# EAGLE schematic Hive 2.0 (EAGLE 9.6.2)
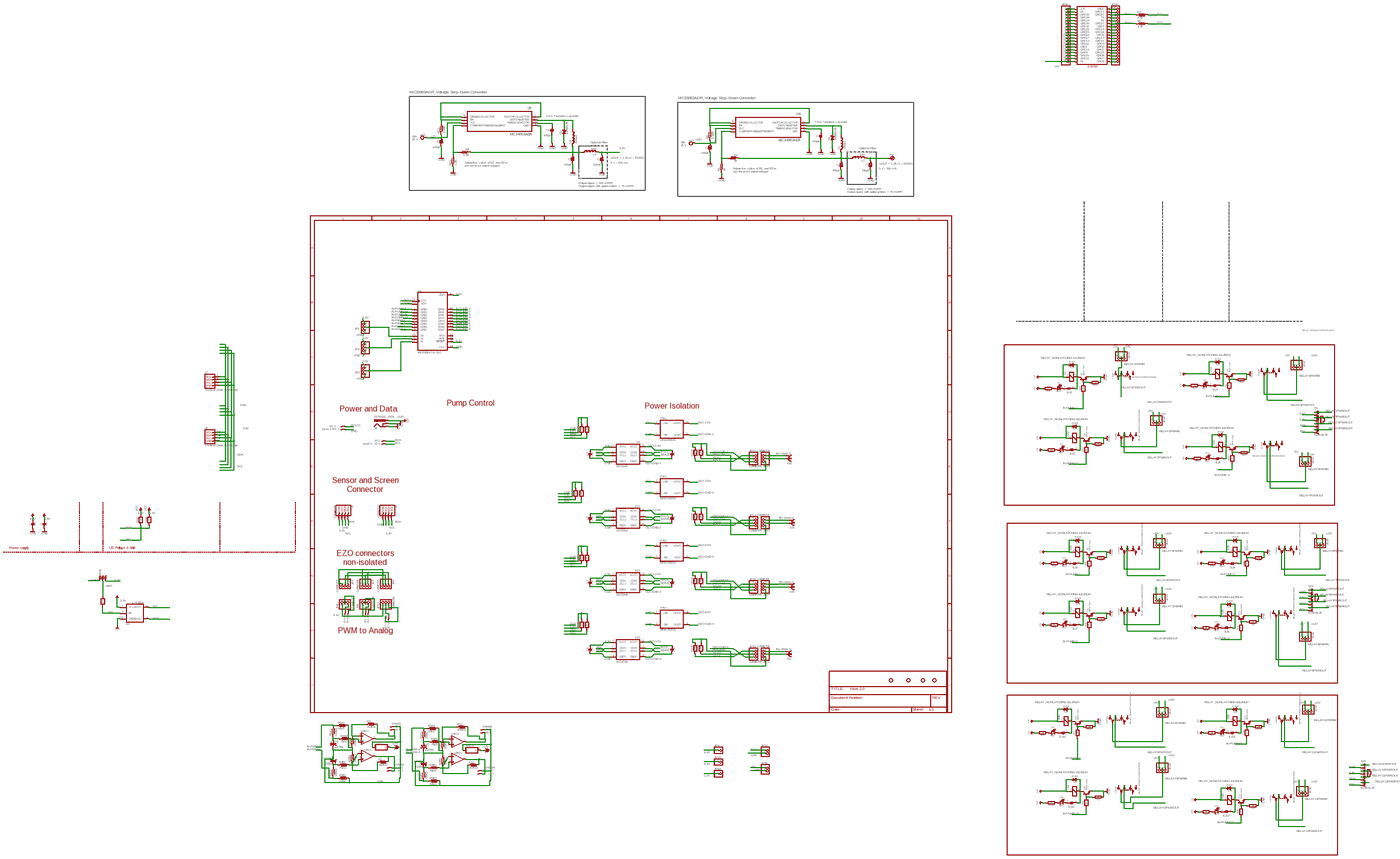
[diagram p0: schematic, sheet 1, overview]
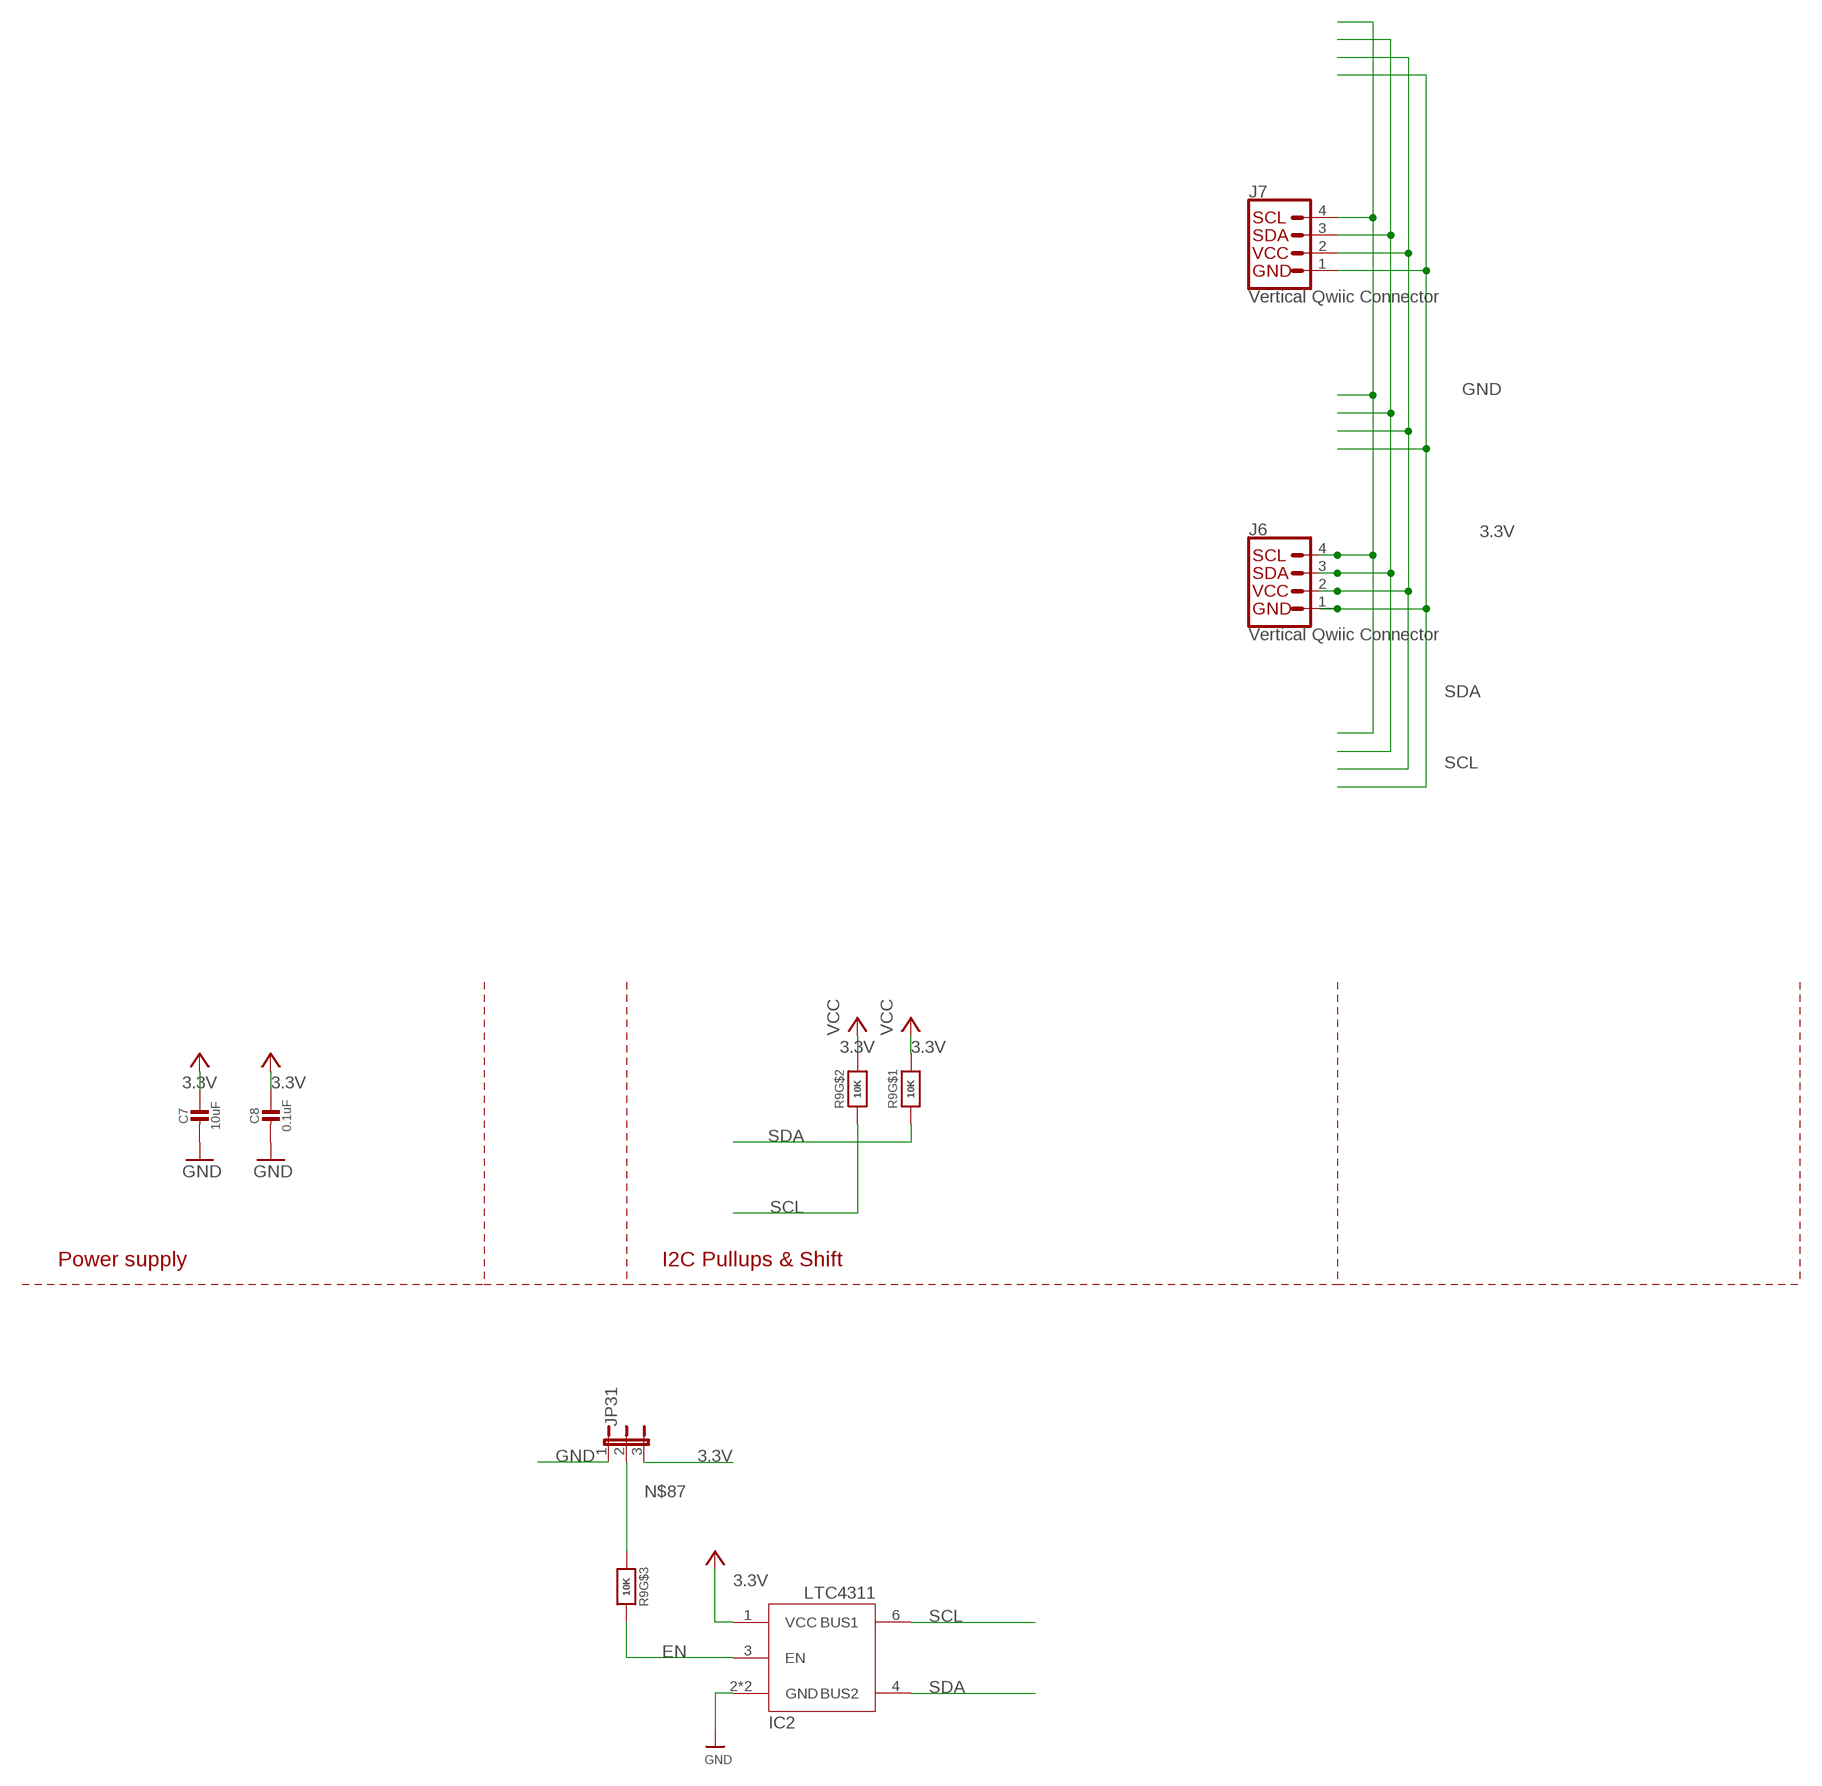
[diagram p1: schematic, sheet 1, part 1 of 6]
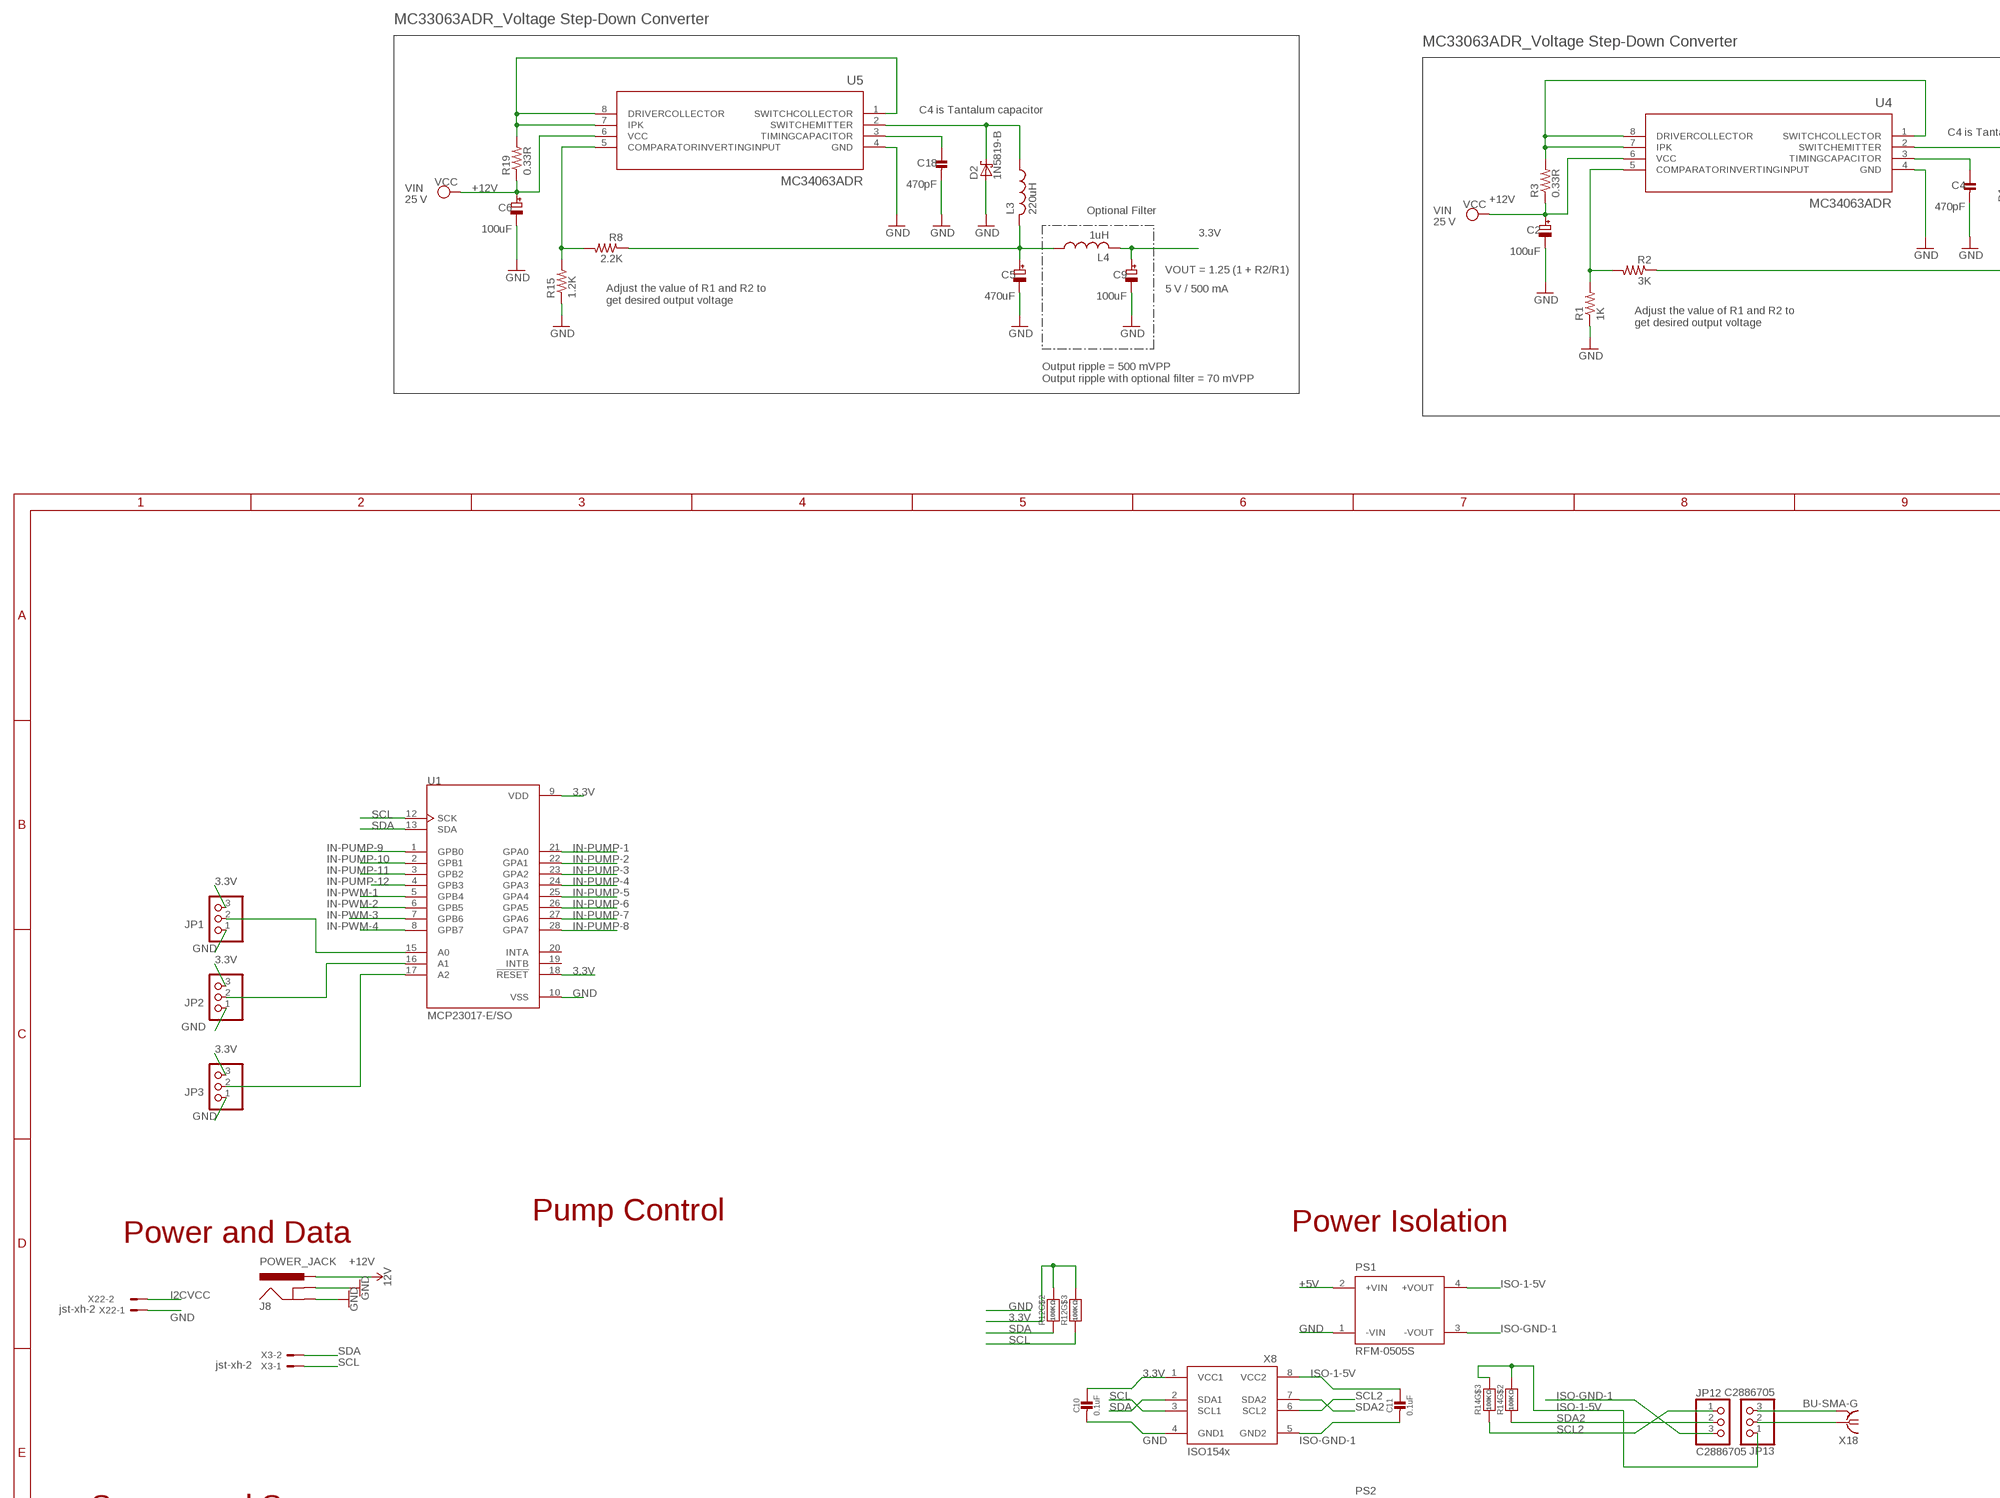
[diagram p2: schematic, sheet 1, part 2 of 6]
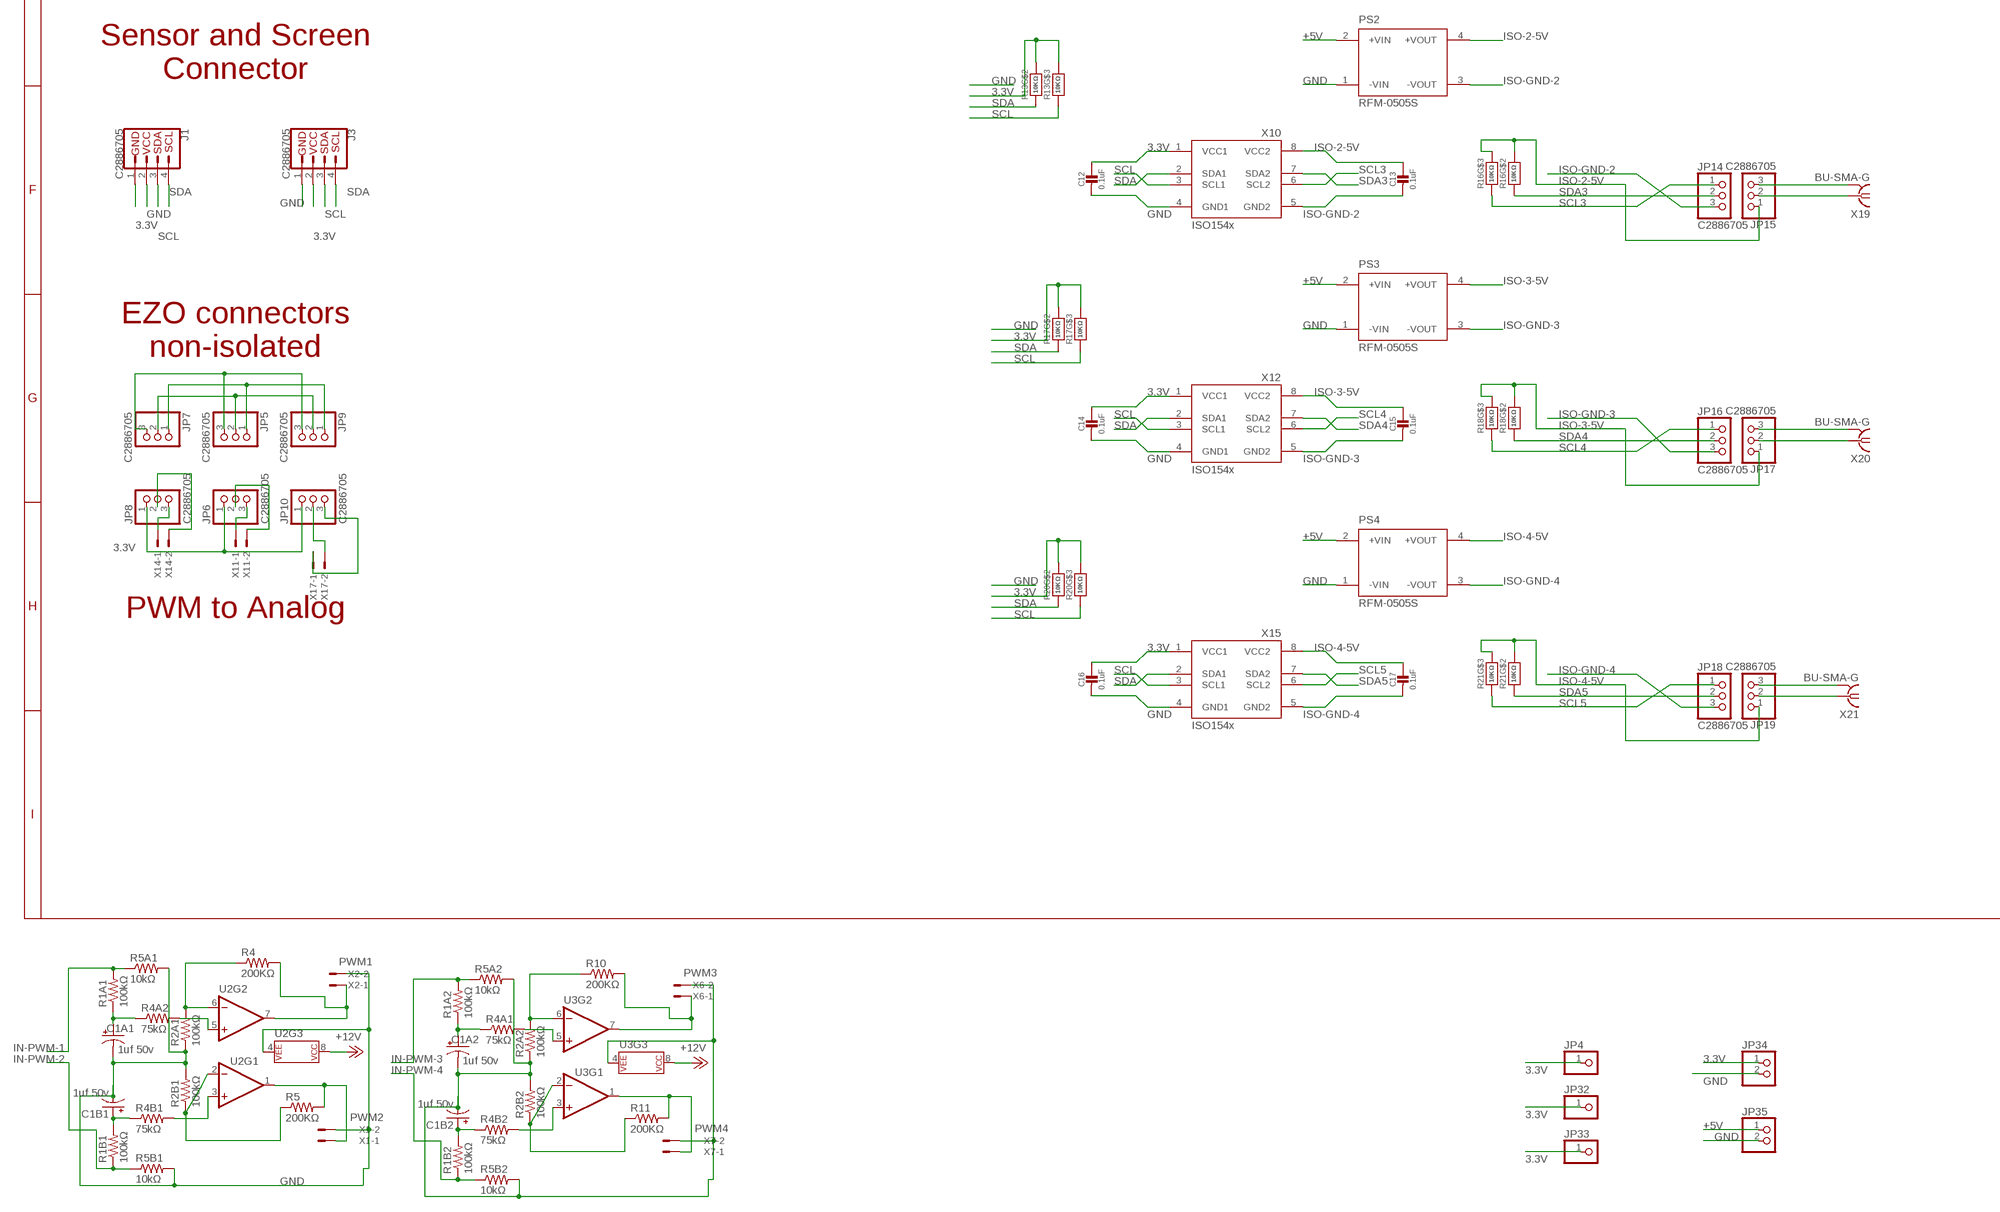
[diagram p3: schematic, sheet 1, part 3 of 6]
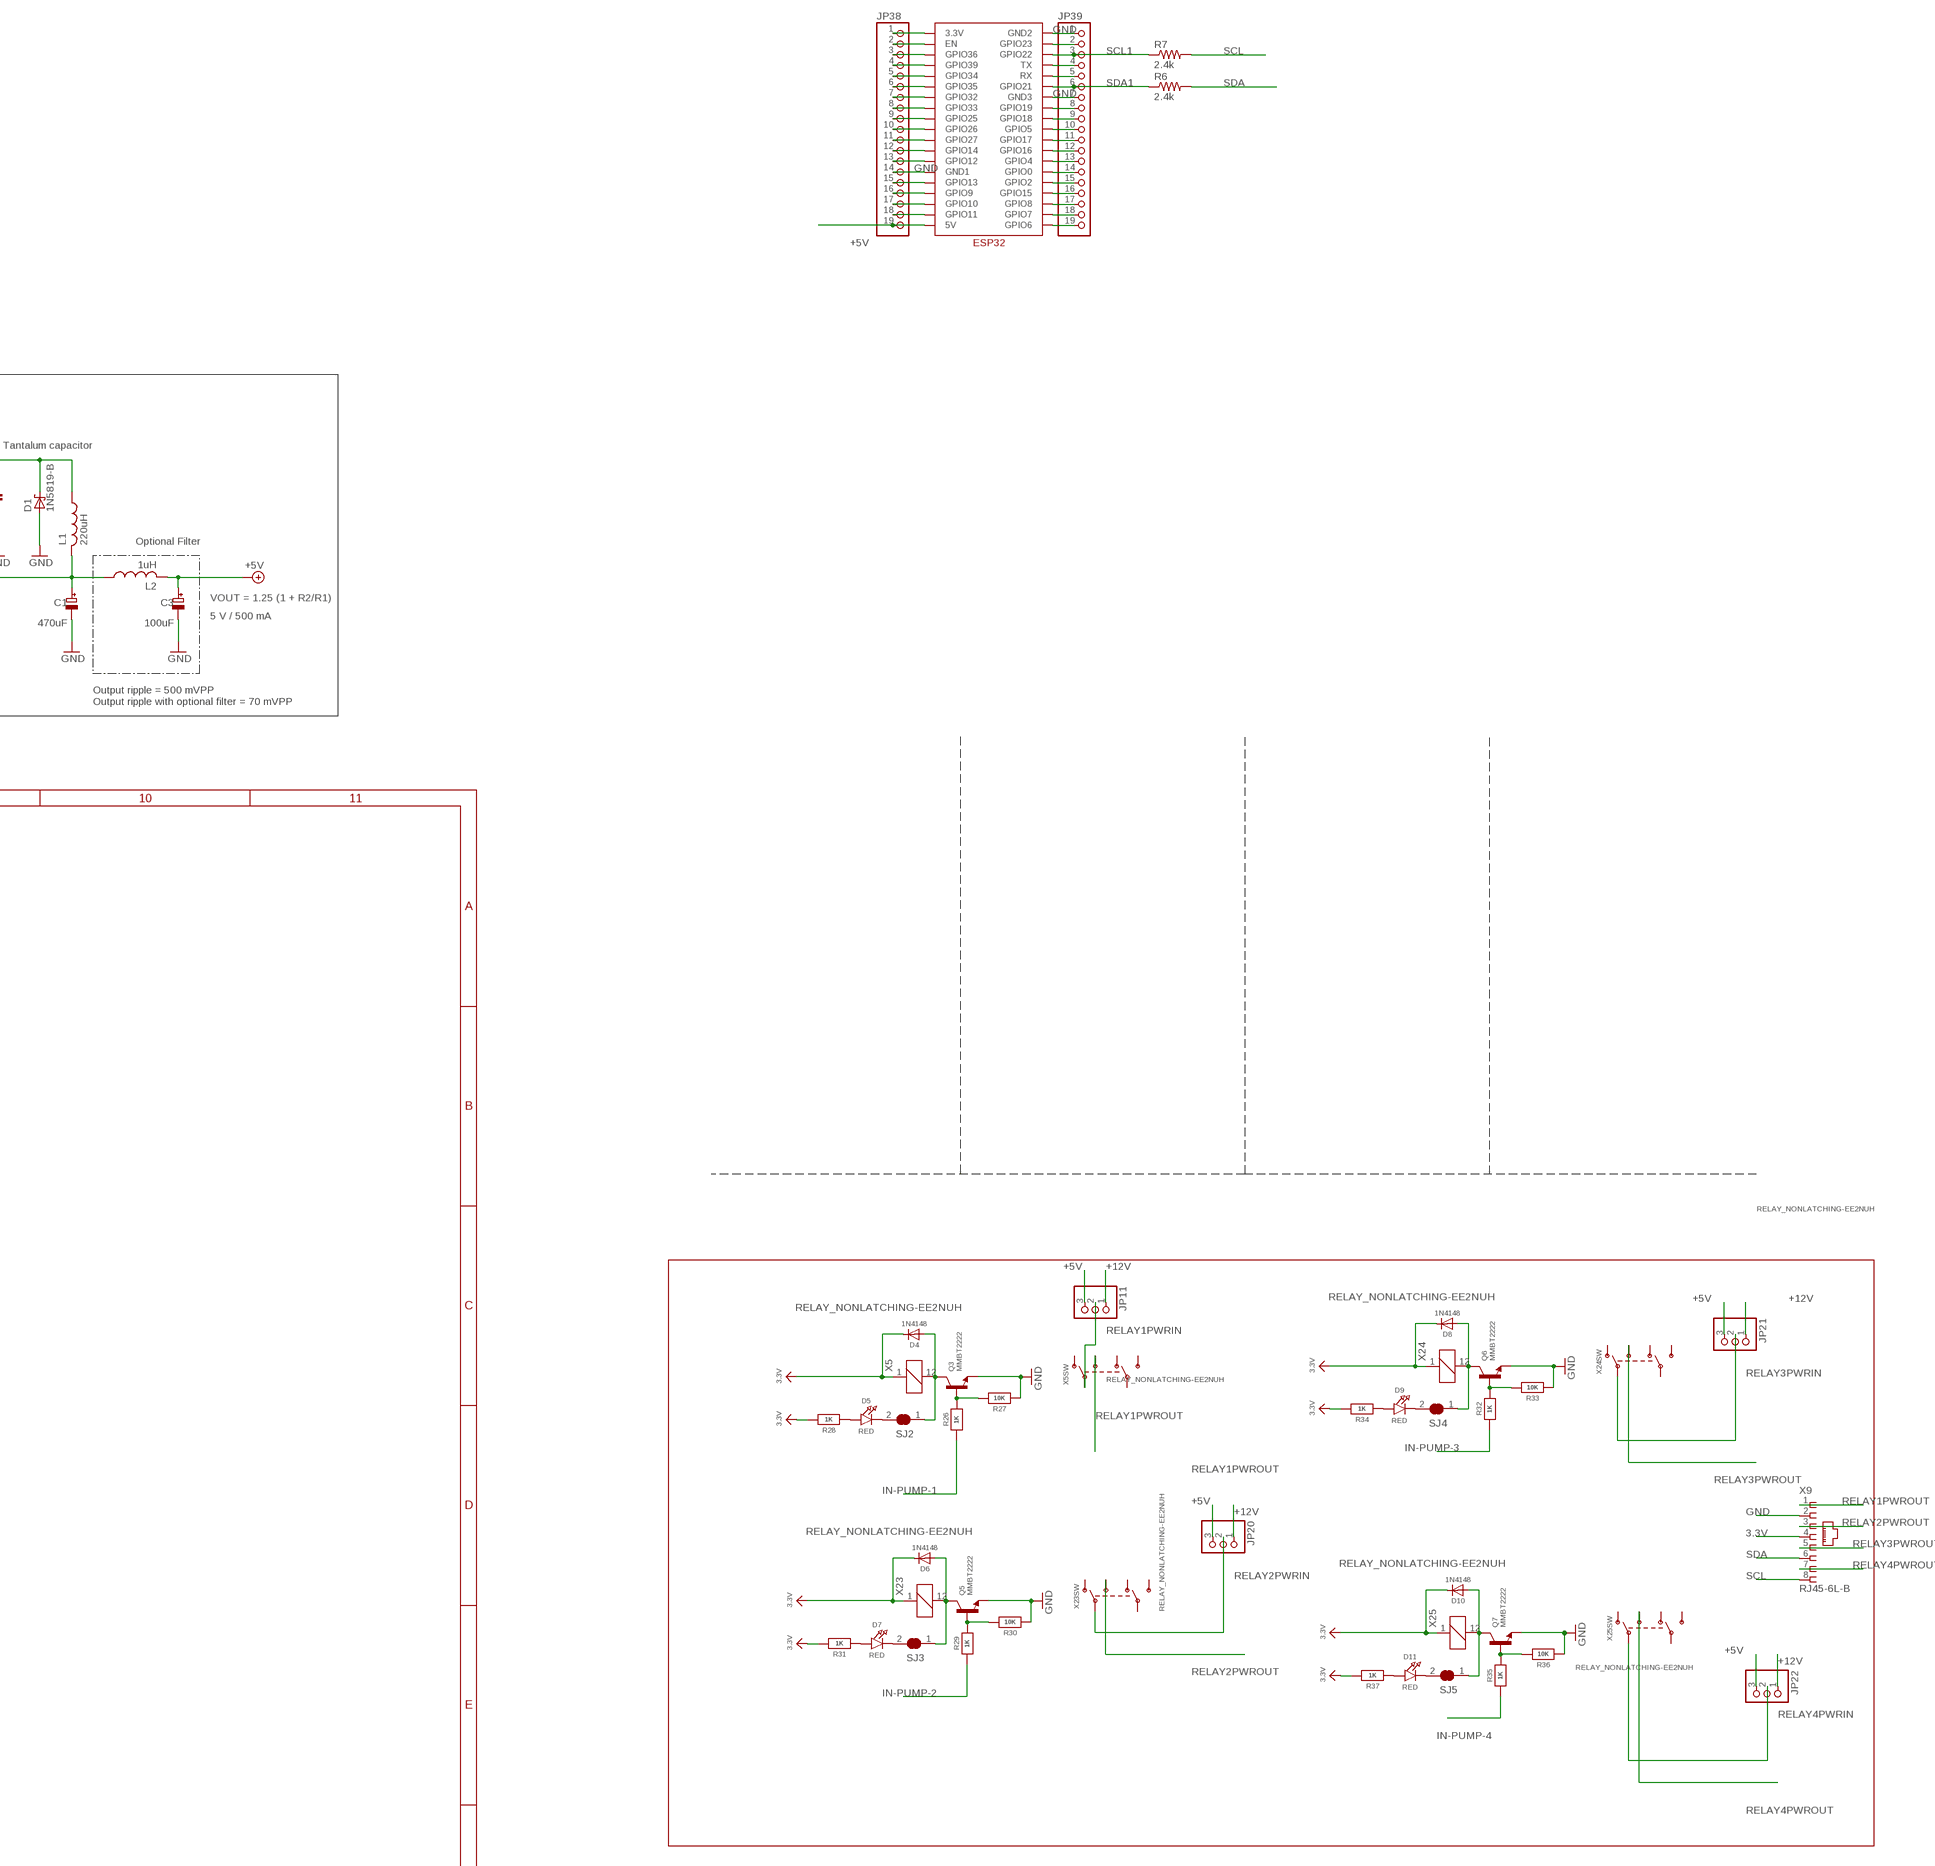
[diagram p4: schematic, sheet 1, part 4 of 6]
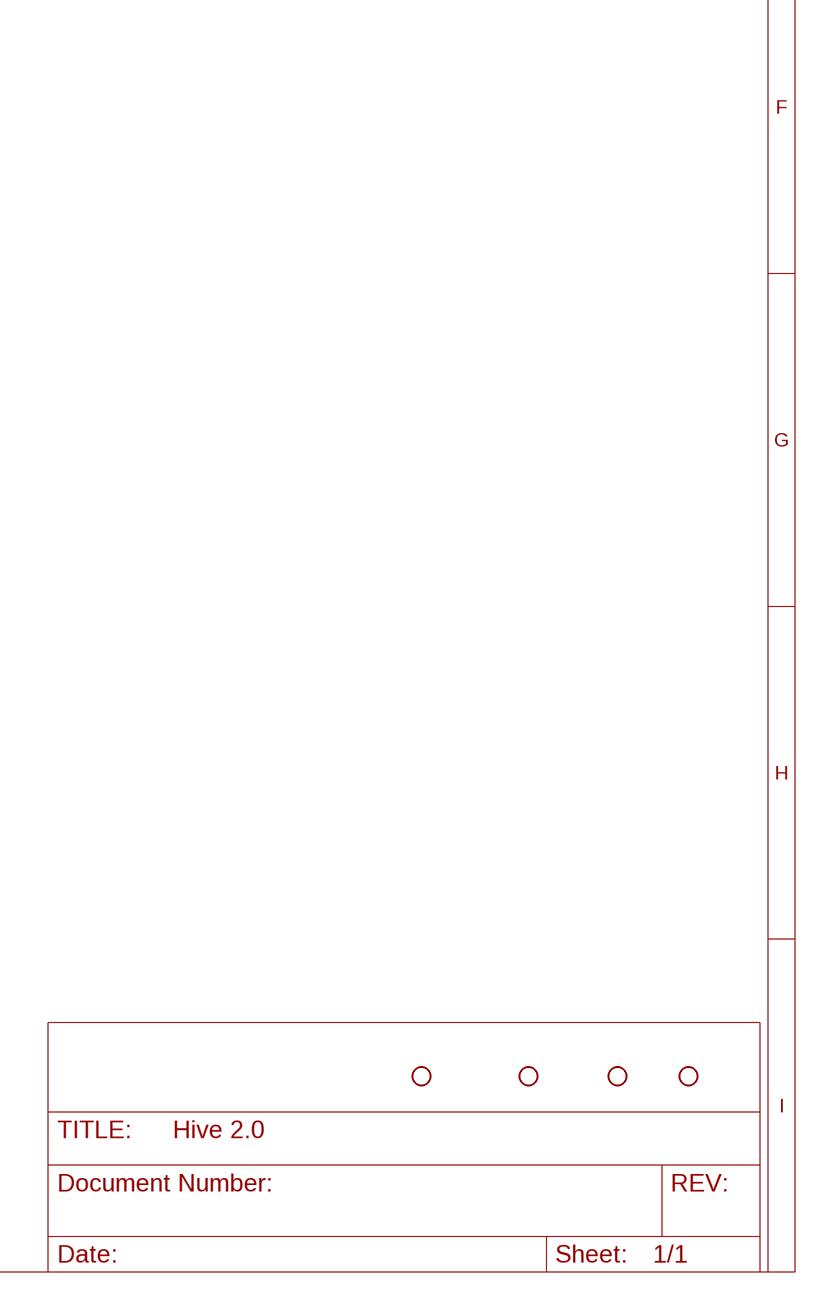
[diagram p5: schematic, sheet 1, part 5 of 6]
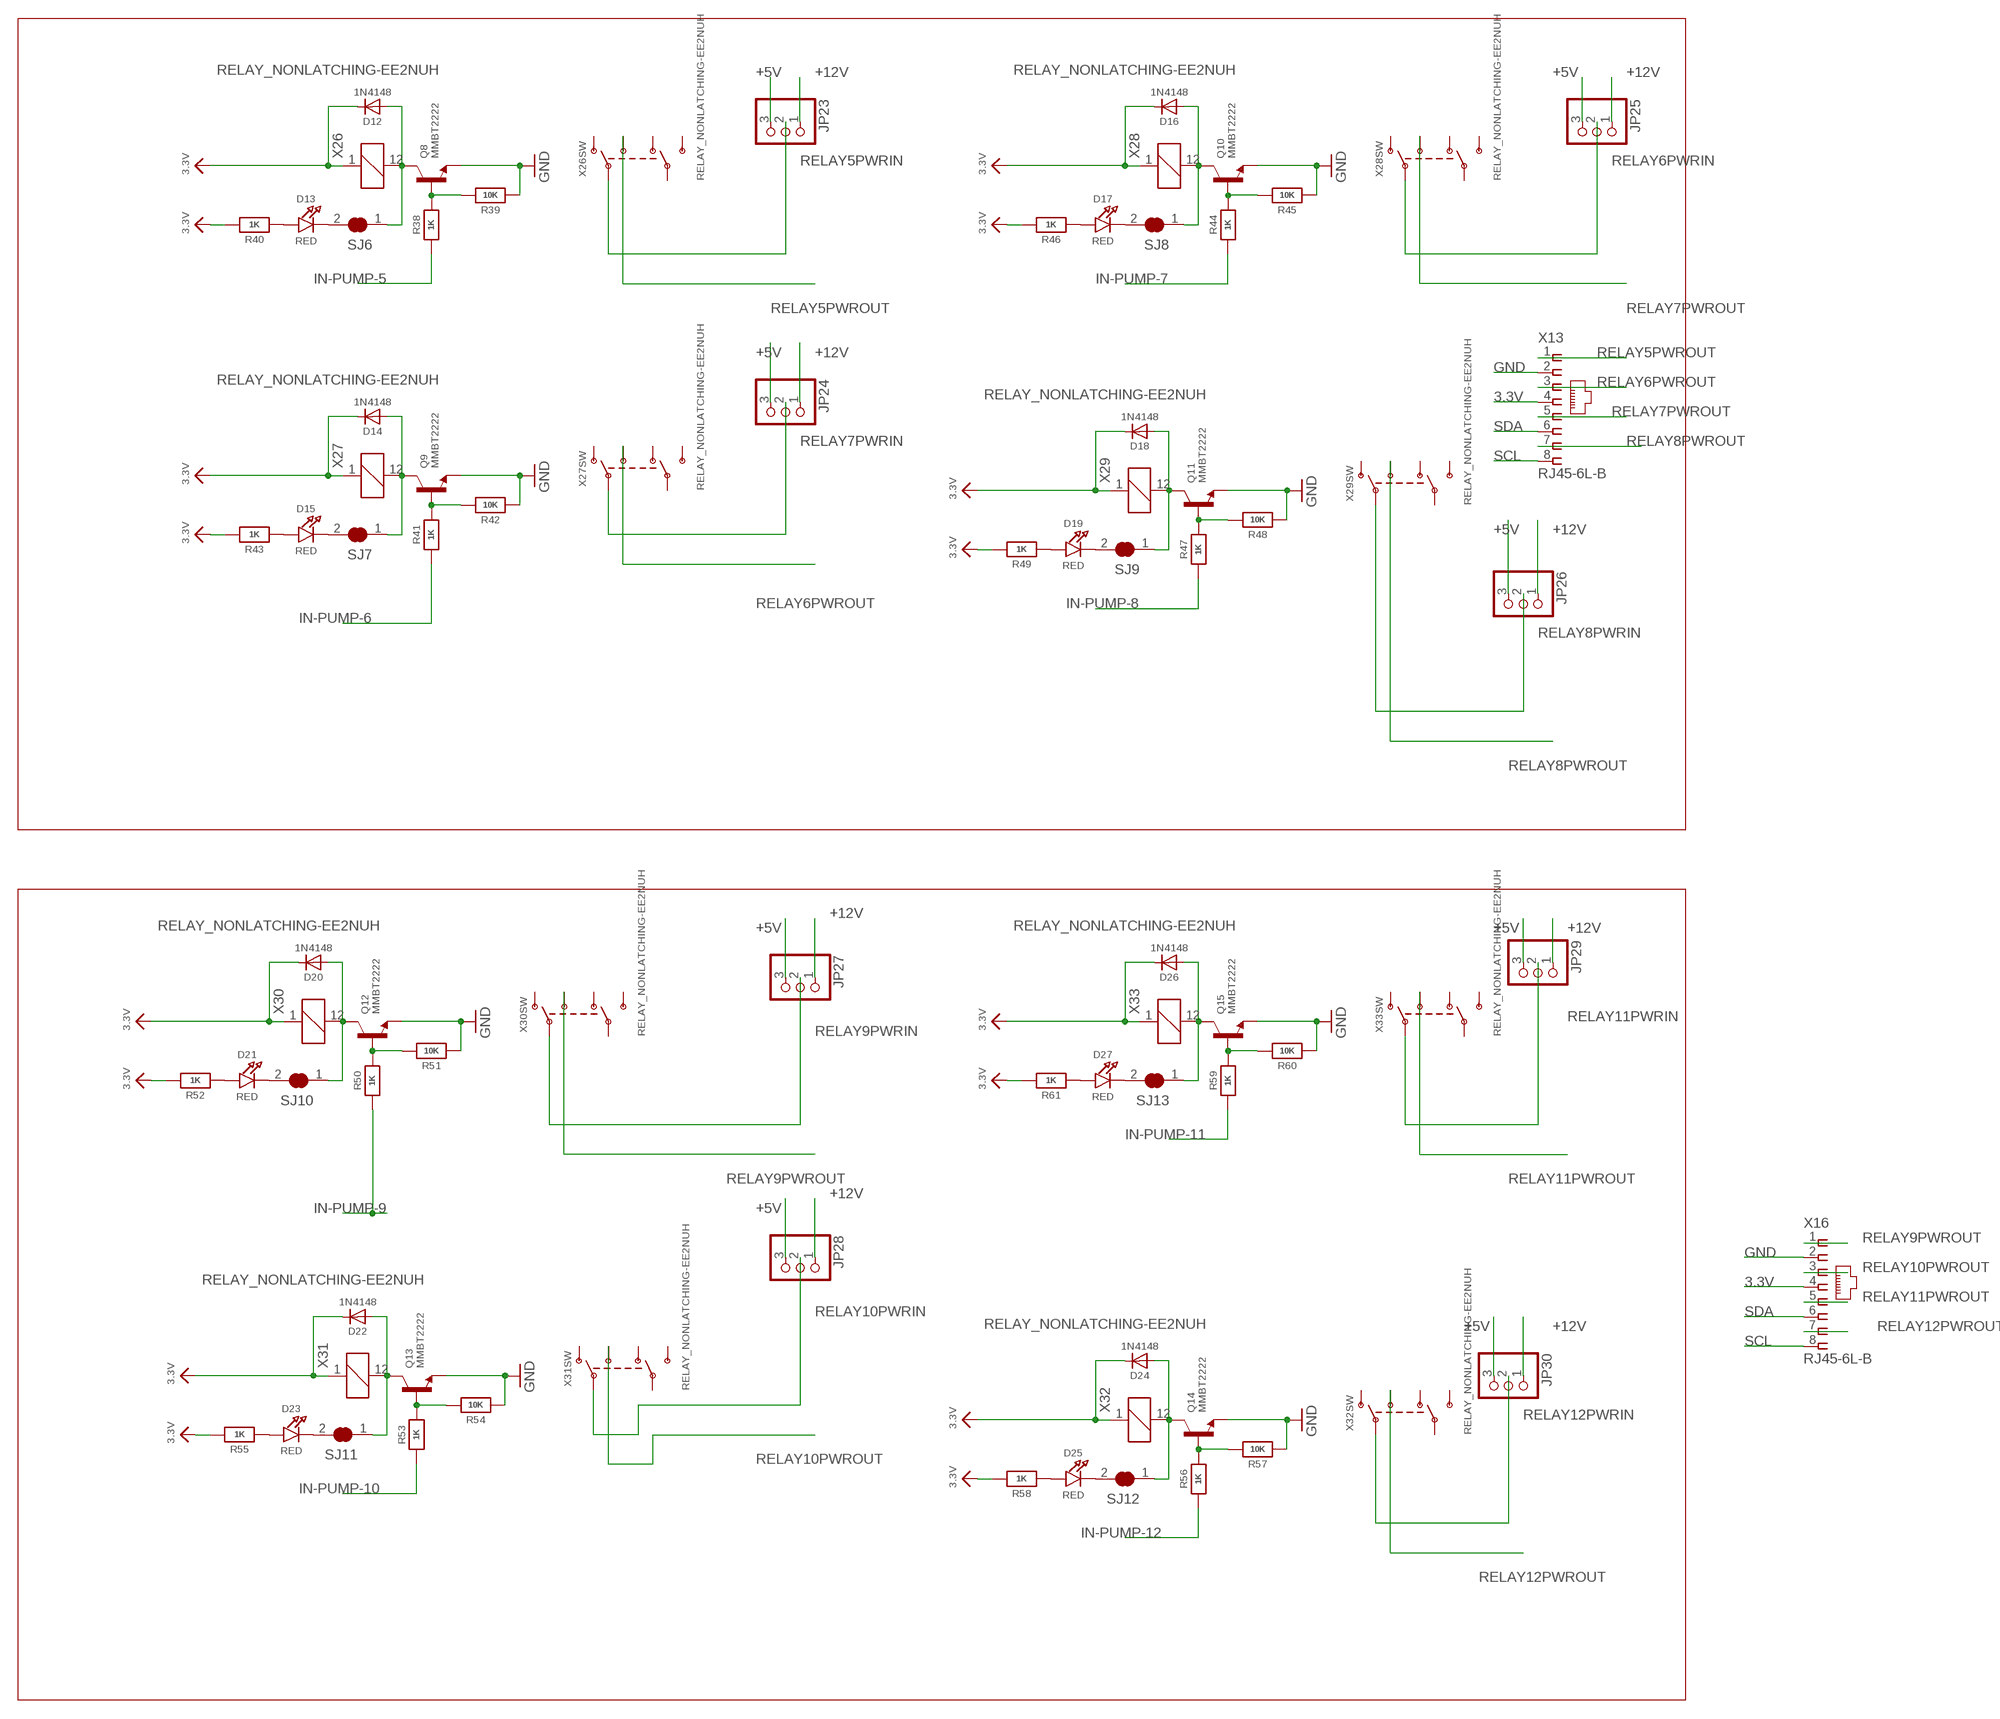
[diagram p6: schematic, sheet 1, part 6 of 6]

## Parts
C1  470uF  CAP_ELECTROLYTICPANASONIC_C  [PANASONIC_C]
C1A1  1uf 50v  CPOL-USUD-4X5,8  [UD-4X5,8_NICHICON]
C1A2  1uf 50v  CPOL-USUD-4X5,8  [UD-4X5,8_NICHICON]
C1B1  1uf 50v  CPOL-USUD-4X5,8  [UD-4X5,8_NICHICON]
C1B2  1uf 50v  CPOL-USUD-4X5,8  [UD-4X5,8_NICHICON]
C2  100uF  CAP_ELECTROLYTICPANASONIC_C  [PANASONIC_C]
C3  100uF  CAP_ELECTROLYTICPANASONIC_C  [PANASONIC_C]
C4  470pF  CAP_CERAMIC0805  [0805]
C5  470uF  CAP_ELECTROLYTICPANASONIC_C  [PANASONIC_C]
C6  100uF  CAP_ELECTROLYTICPANASONIC_C  [PANASONIC_C]
C7  10uF  CAP_CERAMIC0402  [0402]
C8  0.1uF  CAP_CERAMIC0805  [0805]
C9  100uF  CAP_ELECTROLYTICPANASONIC_C  [PANASONIC_C]
C10  0.1uF  CAP_CERAMIC0805  [0805]
C11  0.1uF  CAP_CERAMIC0805  [0805]
C12  0.1uF  CAP_CERAMIC0805  [0805]
C13  0.1uF  CAP_CERAMIC0805  [0805]
C14  0.1uF  CAP_CERAMIC0805  [0805]
C15  0.1uF  CAP_CERAMIC0805  [0805]
C16  0.1uF  CAP_CERAMIC0805  [0805]
C17  0.1uF  CAP_CERAMIC0805  [0805]
C18  470pF  CAP_CERAMIC0805  [0805]
D1  1N5819-B  [DO41-7.6]
D2  1N5819-B  [DO41-7.6]
D4  1N4148  DIODESOD-323  [SOD-323]
D5  RED  LED0805_NOOUTLINE  [CHIPLED_0805_NOOUTLINE]
D6  1N4148  DIODESOD-323  [SOD-323]
D7  RED  LED0805_NOOUTLINE  [CHIPLED_0805_NOOUTLINE]
D8  1N4148  DIODESOD-323  [SOD-323]
D9  RED  LED0805_NOOUTLINE  [CHIPLED_0805_NOOUTLINE]
D10  1N4148  DIODESOD-323  [SOD-323]
D11  RED  LED0805_NOOUTLINE  [CHIPLED_0805_NOOUTLINE]
D12  1N4148  DIODESOD-323  [SOD-323]
D13  RED  LED0805_NOOUTLINE  [CHIPLED_0805_NOOUTLINE]
D14  1N4148  DIODESOD-323  [SOD-323]
D15  RED  LED0805_NOOUTLINE  [CHIPLED_0805_NOOUTLINE]
D16  1N4148  DIODESOD-323  [SOD-323]
D17  RED  LED0805_NOOUTLINE  [CHIPLED_0805_NOOUTLINE]
D18  1N4148  DIODESOD-323  [SOD-323]
D19  RED  LED0805_NOOUTLINE  [CHIPLED_0805_NOOUTLINE]
D20  1N4148  DIODESOD-323  [SOD-323]
D21  RED  LED0805_NOOUTLINE  [CHIPLED_0805_NOOUTLINE]
D22  1N4148  DIODESOD-323  [SOD-323]
D23  RED  LED0805_NOOUTLINE  [CHIPLED_0805_NOOUTLINE]
D24  1N4148  DIODESOD-323  [SOD-323]
D25  RED  LED0805_NOOUTLINE  [CHIPLED_0805_NOOUTLINE]
D26  1N4148  DIODESOD-323  [SOD-323]
D27  RED  LED0805_NOOUTLINE  [CHIPLED_0805_NOOUTLINE]
H1  STAND-OFF  [STAND-OFF]
H2  STAND-OFF  [STAND-OFF]
H3  STAND-OFF  [STAND-OFF]
H4  STAND-OFF  [STAND-OFF]
IC2  LTC4311_SC70  [SC70-6L]
J1  C2886705  I2C_STANDARD  [1X04]
J3  C2886705  I2C_STANDARD  [1X04]
J6  Vertical Qwiic Connector  QWIIC_CONNECTOR  [JST04_1MM_VERT]
J7  Vertical Qwiic Connector  QWIIC_CONNECTOR  [JST04_1MM_VERT]
J8  POWER_JACK  [POWER_JACK_PTH]
JP1  HEADER-1X3ROUND  [1X03_ROUND]
JP2  HEADER-1X3ROUND  [1X03_ROUND]
JP3  HEADER-1X3ROUND  [1X03_ROUND]
JP4  HEADER-1X12MM  [1X01_2MM]
JP5  C2886705  PINHD-1X3CB  [1X03-CLEANBIG]
JP6  C2886705  PINHD-1X3CB  [1X03-CLEANBIG]
JP7  C2886705  PINHD-1X3CB  [1X03-CLEANBIG]
JP8  C2886705  PINHD-1X3CB  [1X03-CLEANBIG]
JP9  C2886705  PINHD-1X3CB  [1X03-CLEANBIG]
JP10  C2886705  PINHD-1X3CB  [1X03-CLEANBIG]
JP11  PINHD-1X3  [1X03]
JP12  C2886705  PINHD-1X3CB  [1X03-CLEANBIG]
JP13  C2886705  PINHD-1X3CB  [1X03-CLEANBIG]
JP14  C2886705  PINHD-1X3CB  [1X03-CLEANBIG]
JP15  C2886705  PINHD-1X3CB  [1X03-CLEANBIG]
JP16  C2886705  PINHD-1X3CB  [1X03-CLEANBIG]
JP17  C2886705  PINHD-1X3CB  [1X03-CLEANBIG]
JP18  C2886705  PINHD-1X3CB  [1X03-CLEANBIG]
JP19  C2886705  PINHD-1X3CB  [1X03-CLEANBIG]
JP20  PINHD-1X3  [1X03]
JP21  PINHD-1X3  [1X03]
JP22  PINHD-1X3  [1X03]
JP23  PINHD-1X3  [1X03]
JP24  PINHD-1X3  [1X03]
JP25  PINHD-1X3  [1X03]
JP26  PINHD-1X3  [1X03]
JP27  PINHD-1X3  [1X03]
JP28  PINHD-1X3  [1X03]
JP29  PINHD-1X3  [1X03]
JP30  PINHD-1X3  [1X03]
JP31  JUMPER3  [JUMPER3]
JP32  HEADER-1X12MM  [1X01_2MM]
JP33  HEADER-1X12MM  [1X01_2MM]
JP34  HEADER-1X2ROUND  [1X02_ROUND]
JP35  HEADER-1X2ROUND  [1X02_ROUND]
JP38  PINHD-1X19  [1X19]
JP39  PINHD-1X19  [1X19]
L1  220uH  L-USL3216C  [L3216C]
L2  1uH  L-USL3216C  [L3216C]
L3  220uH  L-USL3216C  [L3216C]
L4  1uH  L-USL3216C  [L3216C]
PS1  RFM-0505S  [CONV_RFM-0505S]
PS2  RFM-0505S  [CONV_RFM-0505S]
PS3  RFM-0505S  [CONV_RFM-0505S]
PS4  RFM-0505S  [CONV_RFM-0505S]
Q3  MMBT2222  TRANSISTOR_NPN  [SOT23-R]
Q5  MMBT2222  TRANSISTOR_NPN  [SOT23-R]
Q6  MMBT2222  TRANSISTOR_NPN  [SOT23-R]
Q7  MMBT2222  TRANSISTOR_NPN  [SOT23-R]
Q8  MMBT2222  TRANSISTOR_NPN  [SOT23-R]
Q9  MMBT2222  TRANSISTOR_NPN  [SOT23-R]
Q10  MMBT2222  TRANSISTOR_NPN  [SOT23-R]
Q11  MMBT2222  TRANSISTOR_NPN  [SOT23-R]
Q12  MMBT2222  TRANSISTOR_NPN  [SOT23-R]
Q13  MMBT2222  TRANSISTOR_NPN  [SOT23-R]
Q14  MMBT2222  TRANSISTOR_NPN  [SOT23-R]
Q15  MMBT2222  TRANSISTOR_NPN  [SOT23-R]
R1  1K  R-US_M0805  [M0805]
R1A1  100kΩ  R-US_M1206  [M1206]
R1A2  100kΩ  R-US_M1206  [M1206]
R1B1  100kΩ  R-US_M1206  [M1206]
R1B2  100kΩ  R-US_M1206  [M1206]
R2  3K  R-US_M0805  [M0805]
R2A1  100kΩ  R-US_M1206  [M1206]
R2A2  100kΩ  R-US_M1206  [M1206]
R2B1  100kΩ  R-US_M1206  [M1206]
R2B2  100kΩ  R-US_M1206  [M1206]
R3  0.33R  R-US_M0805  [M0805]
R4  200KΩ  R-US_R0402  [R0402]
R4A1  75kΩ  R-US_M1206  [M1206]
R4A2  75kΩ  R-US_M1206  [M1206]
R4B1  75kΩ  R-US_M1206  [M1206]
R4B2  75kΩ  R-US_M1206  [M1206]
R5  200KΩ  R-US_R0402  [R0402]
R5A1  10kΩ  R-US_M1206  [M1206]
R5A2  10kΩ  R-US_M1206  [M1206]
R5B1  10kΩ  R-US_M1206  [M1206]
R5B2  10kΩ  R-US_M1206  [M1206]
R6  2.4k  R-US_0309/12  [0309/12]
R7  2.4k  R-US_0309/12  [0309/12]
R8  2.2K  R-US_M0805  [M0805]
R9  10K  RESISTOR_4PACK  [RESPACK_4X0603]
R10  200KΩ  R-US_R0402  [R0402]
R11  200KΩ  R-US_R0402  [R0402]
R12  100KΩ  RESISTOR_4PACK  [RESPACK_4X0603]
R13  10KΩ  RESISTOR_4PACK  [RESPACK_4X0603]
R14  100KΩ  RESISTOR_4PACK  [RESPACK_4X0603]
R15  1.2K  R-US_M0805  [M0805]
R16  10KΩ  RESISTOR_4PACK  [RESPACK_4X0603]
R17  10KΩ  RESISTOR_4PACK  [RESPACK_4X0603]
R18  10KΩ  RESISTOR_4PACK  [RESPACK_4X0603]
R19  0.33R  R-US_M0805  [M0805]
R20  10KΩ  RESISTOR_4PACK  [RESPACK_4X0603]
R21  10KΩ  RESISTOR_4PACK  [RESPACK_4X0603]
R26  1K  RESISTOR0402  [0402]
R27  10K  RESISTOR0402  [0402]
R28  1K  RESISTOR0402  [0402]
R29  1K  RESISTOR0402  [0402]
R30  10K  RESISTOR0402  [0402]
R31  1K  RESISTOR0402  [0402]
R32  1K  RESISTOR0402  [0402]
R33  10K  RESISTOR0402  [0402]
R34  1K  RESISTOR0402  [0402]
R35  1K  RESISTOR0402  [0402]
R36  10K  RESISTOR0402  [0402]
R37  1K  RESISTOR0402  [0402]
R38  1K  RESISTOR0402  [0402]
R39  10K  RESISTOR0402  [0402]
R40  1K  RESISTOR0402  [0402]
R41  1K  RESISTOR0402  [0402]
R42  10K  RESISTOR0402  [0402]
R43  1K  RESISTOR0402  [0402]
R44  1K  RESISTOR0402  [0402]
R45  10K  RESISTOR0402  [0402]
R46  1K  RESISTOR0402  [0402]
R47  1K  RESISTOR0402  [0402]
R48  10K  RESISTOR0402  [0402]
R49  1K  RESISTOR0402  [0402]
R50  1K  RESISTOR0402  [0402]
R51  10K  RESISTOR0402  [0402]
R52  1K  RESISTOR0402  [0402]
R53  1K  RESISTOR0402  [0402]
R54  10K  RESISTOR0402  [0402]
R55  1K  RESISTOR0402  [0402]
R56  1K  RESISTOR0402  [0402]
R57  10K  RESISTOR0402  [0402]
R58  1K  RESISTOR0402  [0402]
R59  1K  RESISTOR0402  [0402]
R60  10K  RESISTOR0402  [0402]
R61  1K  RESISTOR0402  [0402]
SJ2  SOLDERJUMPER_CLOSED  [SOLDERJUMPER_CLOSEDWIRE]
SJ3  SOLDERJUMPER_CLOSED  [SOLDERJUMPER_CLOSEDWIRE]
SJ4  SOLDERJUMPER_CLOSED  [SOLDERJUMPER_CLOSEDWIRE]
SJ5  SOLDERJUMPER_CLOSED  [SOLDERJUMPER_CLOSEDWIRE]
SJ6  SOLDERJUMPER_CLOSED  [SOLDERJUMPER_CLOSEDWIRE]
SJ7  SOLDERJUMPER_CLOSED  [SOLDERJUMPER_CLOSEDWIRE]
SJ8  SOLDERJUMPER_CLOSED  [SOLDERJUMPER_CLOSEDWIRE]
SJ9  SOLDERJUMPER_CLOSED  [SOLDERJUMPER_CLOSEDWIRE]
SJ10  SOLDERJUMPER_CLOSED  [SOLDERJUMPER_CLOSEDWIRE]
SJ11  SOLDERJUMPER_CLOSED  [SOLDERJUMPER_CLOSEDWIRE]
SJ12  SOLDERJUMPER_CLOSED  [SOLDERJUMPER_CLOSEDWIRE]
SJ13  SOLDERJUMPER_CLOSED  [SOLDERJUMPER_CLOSEDWIRE]
U1  MCP23017-E/SO  [SOIC127P1030X265-28N]
U2  LM358  LM358SO08  [SO08]
U3  LM358  LM358SO08  [SO08]
U4  MC34063ADR  [D8]
U5  MC34063ADR  [D8]
U$2  ESP32  [ESP32]
X1  PWM2  JST-XH-02-PIN-LONG-PAD  [JST-XH-02-PACKAGE-LONG-PAD]
X2  PWM1  JST-XH-02-PIN-LONG-PAD  [JST-XH-02-PACKAGE-LONG-PAD]
X3  jst-xh-2  JST-XH-02-PIN-LONG-PAD  [JST-XH-02-PACKAGE-LONG-PAD]
X5  RELAY_NONLATCHING-EE2NUH  [RELAY_EE2_NOLATCH]
X6  PWM3  JST-XH-02-PIN-LONG-PAD  [JST-XH-02-PACKAGE-LONG-PAD]
X7  PWM4  JST-XH-02-PIN-LONG-PAD  [JST-XH-02-PACKAGE-LONG-PAD]
X8  ISO154X  [SOIC8_150MIL]
X9  RJ45-6L-B  [RJ45-NO-SHIELD]
X10  ISO154X  [SOIC8_150MIL]
X11  jst-xh-2  JST-XH-02-PIN-LONG-PAD  [JST-XH-02-PACKAGE-LONG-PAD]
X12  ISO154X  [SOIC8_150MIL]
X13  RJ45-6L-B  [RJ45-NO-SHIELD]
X14  jst-xh-2  JST-XH-02-PIN-LONG-PAD  [JST-XH-02-PACKAGE-LONG-PAD]
X15  ISO154X  [SOIC8_150MIL]
X16  RJ45-6L-B  [RJ45-NO-SHIELD]
X17  jst-xh-2  JST-XH-02-PIN-LONG-PAD  [JST-XH-02-PACKAGE-LONG-PAD]
X18  BU-SMA-G  [BU-SMA-G]
X19  BU-SMA-G  [BU-SMA-G]
X20  BU-SMA-G  [BU-SMA-G]
X21  BU-SMA-G  [BU-SMA-G]
X22  jst-xh-2  JST-XH-02-PIN-LONG-PAD  [JST-XH-02-PACKAGE-LONG-PAD]
X23  RELAY_NONLATCHING-EE2NUH  [RELAY_EE2_NOLATCH]
X24  RELAY_NONLATCHING-EE2NUH  [RELAY_EE2_NOLATCH]
X25  RELAY_NONLATCHING-EE2NUH  [RELAY_EE2_NOLATCH]
X26  RELAY_NONLATCHING-EE2NUH  [RELAY_EE2_NOLATCH]
X27  RELAY_NONLATCHING-EE2NUH  [RELAY_EE2_NOLATCH]
X28  RELAY_NONLATCHING-EE2NUH  [RELAY_EE2_NOLATCH]
X29  RELAY_NONLATCHING-EE2NUH  [RELAY_EE2_NOLATCH]
X30  RELAY_NONLATCHING-EE2NUH  [RELAY_EE2_NOLATCH]
X31  RELAY_NONLATCHING-EE2NUH  [RELAY_EE2_NOLATCH]
X32  RELAY_NONLATCHING-EE2NUH  [RELAY_EE2_NOLATCH]
X33  RELAY_NONLATCHING-EE2NUH  [RELAY_EE2_NOLATCH]

## Nets
3.3V: C7.1 C8.1 C9.+ C10.1 C12.1 C14.1 C16.1 D4.C D6.C D8.C D10.C D12.C D14.C D16.C D18.C D20.C D22.C D24.C D26.C IC2.1(VCC) J1.1 J3.2 J6.3 J7.3 JP1.3 JP2.3 JP3.3 JP4.1 JP6.1 JP8.1 JP10.1 JP31.3 JP32.1 JP33.1 JP34.1 L4.2 R9.7 R9.8 R12.6 R12.7 R13.6 R13.7 R17.6 R17.7 R20.6 R20.7 R28.2 R31.2 R34.2 R37.2 R40.2 R43.2 R46.2 R49.2 R52.2 R55.2 R58.2 R61.2 U1.9(VDD) U1.18(!RESET) X5.1 X8.1(VCC1) X9.4 X10.1(VCC1) X12.1(VCC1) X13.4 X15.1(VCC1) X16.4 X23.1 X24.1 X25.1 X26.1 X27.1 X28.1 X29.1 X30.1 X31.1 X32.1 X33.1 ; supply symbol labelled VCC
+5V [5v]: C3.+ JP11.3 JP20.3 JP21.3 JP22.3 JP23.3 JP24.3 JP25.3 JP26.3 JP27.3 JP28.3 JP29.3 JP30.3 JP35.1 JP38.19 L2.2 PS1.2(+VIN) PS2.2(+VIN) PS3.2(+VIN) PS4.2(+VIN) U$2.5V
+12V [12v]: C2.+ C6.+ J8.PWR JP11.1 JP20.1 JP21.1 JP22.1 JP23.1 JP24.1 JP25.1 JP26.1 JP27.1 JP28.1 JP29.1 JP30.1 R3.1 R19.1 U2.8(P$V+) U3.8(P$V+) U4.6(VCC) U5.6(VCC) ; supply symbol labelled 12V, VCC
EN: IC2.3(EN) R9.6
GND: C1.- C1A1.- C1A2.- C1B1.- C1B2.- C2.- C3.- C4.2 C5.- C6.- C7.2 C8.2 C9.- C10.2 C12.2 C14.2 C16.2 C18.2 D1.A D2.A IC2.2(GND) IC2.5(GND) J1.2 J3.1 J6.4 J7.4 J8.GND J8.GNDBREAK JP1.1 JP2.1 JP3.1 JP5.3 JP7.3 JP9.3 JP31.1 JP34.2 JP35.2 JP38.14 JP39.1 JP39.7 PS1.1(-VIN) PS2.1(-VIN) PS3.1(-VIN) PS4.1(-VIN) Q3.2(E) Q5.2(E) Q6.2(E) Q7.2(E) Q8.2(E) Q9.2(E) Q10.2(E) Q11.2(E) Q12.2(E) Q13.2(E) Q14.2(E) Q15.2(E) R1.1 R2A1.1 R2A2.1 R2B1.2 R2B2.2 R5A1.2 R5A2.2 R5B1.2 R5B2.2 R15.1 R27.1 R30.1 R33.1 R36.1 R39.1 R42.1 R45.1 R48.1 R51.1 R54.1 R57.1 R60.1 U1.10(VSS) U2.4(P$V-) U3.4(P$V-) U4.4(GND) U5.4(GND) U$2.GND1 U$2.GND2 U$2.GND3 X1.2 X2.2 X6.2 X7.2 X8.4(GND1) X9.2 X10.4(GND1) X12.4(GND1) X13.2 X15.4(GND1) X16.2 X22.1
I2CVCC: X22.2
IN-PUMP-1: R26.1 U1.21(GPA0)
IN-PUMP-2: R29.1 U1.22(GPA1)
IN-PUMP-3: R32.1 U1.23(GPA2)
IN-PUMP-4: R35.1 U1.24(GPA3)
IN-PUMP-5 [GPIO]: R38.1 U1.25(GPA4)
IN-PUMP-6 [GPIO]: R41.1 U1.26(GPA5)
IN-PUMP-7 [GPIO]: R44.1 U1.27(GPA6)
IN-PUMP-8 [GPIO]: R47.1 U1.28(GPA7)
IN-PUMP-9 [GPIO]: R50.1 U1.1(GPB0)
IN-PUMP-10 [GPIO]: R53.1 U1.2(GPB1)
IN-PUMP-11 [GPIO]: R59.1 U1.3(GPB2)
IN-PUMP-12 [GPIO]: R56.1 U1.4(GPB3)
IN-PWM-1: R1A1.2 R5A1.1 U1.5(GPB4)
IN-PWM-2: R1B1.1 R5B1.1 U1.6(GPB5)
IN-PWM-3: R1A2.2 R5A2.1 U1.7(GPB6)
IN-PWM-4: R1B2.1 R5B2.1 U1.8(GPB7)
ISO-1-5V: C11.1 JP13.1 PS1.4(+VOUT) R14.6 R14.7 X8.8(VCC2)
ISO-2-5V: C13.1 JP15.1 PS2.4(+VOUT) R16.6 R16.7 X10.8(VCC2)
ISO-3-5V: C15.1 JP17.1 PS3.4(+VOUT) R18.6 R18.7 X12.8(VCC2)
ISO-4-5V: C17.1 JP19.1 PS4.4(+VOUT) R21.6 R21.7 X15.8(VCC2)
ISO-GND-1: C11.2 JP12.3 PS1.3(-VOUT) X8.5(GND2)
ISO-GND-2: C13.2 JP14.3 PS2.3(-VOUT) X10.5(GND2)
ISO-GND-3: C15.2 JP16.3 PS3.3(-VOUT) X12.5(GND2)
ISO-GND-4: C17.2 JP18.3 PS4.3(-VOUT) X15.5(GND2)
ISO-PRB-1+: JP13.2 X18.1
ISO-PRB-1GND: JP13.3 X18.2 X18.3 X18.4 X18.5
ISO-PRB-2+: JP15.2 X19.1
ISO-PRB-2GND: JP15.3 X19.2 X19.3 X19.4 X19.5
ISO-PRB-3+: JP17.2 X20.1
ISO-PRB-3GND: JP17.3 X20.2 X20.3 X20.4 X20.5
ISO-PRB-4+: JP19.2 X21.1
ISO-PRB-4GND: JP19.3 X21.2 X21.3 X21.4 X21.5
N$1: C1A1.+ R1A1.1 R4A2.1
N$2: D1.C L1.1 U4.2(SWITCHEMITTER)
N$3: C1.+ L1.2 L2.1 R2.1
N$4: C4.1 U4.3(TIMINGCAPACITOR)
N$5: C1B1.+ R1B1.2 R4B1.1
N$6: R2A1.2 R4.1 U2.6(-IN)
N$7: R1.2 R2.2 U4.5(COMPARATORINVERTINGINPUT)
N$8: R2B1.1 R5.1 U2.2(-IN)
N$9: R3.2 U4.1(SWITCHCOLLECTOR) U4.7(IPK) U4.8(DRIVERCOLLECTOR)
N$10: R4A2.2 U2.5(+IN)
N$11: R4B1.2 U2.3(+IN)
N$12: D2.C L3.1 U5.2(SWITCHEMITTER)
N$13: D4.A Q3.3(C) SJ2.1 X5.12
N$14: Q3.1(B) R26.2 R27.2
N$15: D6.A Q5.3(C) SJ3.1 X23.12
N$16: D5.A R28.1
N$17: D5.C SJ2.2
N$18: Q5.1(B) R29.2 R30.2
N$19: D8.A Q6.3(C) SJ4.1 X24.12
N$20: D7.A R31.1
N$21: D7.C SJ3.2
N$22: C18.1 U5.3(TIMINGCAPACITOR)
N$23: Q6.1(B) R32.2 R33.2
N$24: R8.2 R15.2 U5.5(COMPARATORINVERTINGINPUT)
N$25: R19.2 U5.1(SWITCHCOLLECTOR) U5.7(IPK) U5.8(DRIVERCOLLECTOR)
N$26: C5.+ L3.2 L4.1 R8.1
N$27: D10.A Q7.3(C) SJ5.1 X25.12
N$28: D9.A R34.1
N$29: D9.C SJ4.2
N$30: Q7.1(B) R35.2 R36.2
N$31: D12.A Q8.3(C) SJ6.1 X26.12
N$32: D11.A R37.1
N$33: D11.C SJ5.2
N$34: Q8.1(B) R38.2 R39.2
N$35: D14.A Q9.3(C) SJ7.1 X27.12
N$36: D13.A R40.1
N$37: D13.C SJ6.2
N$38: Q9.1(B) R41.2 R42.2
N$39: D16.A Q10.3(C) SJ8.1 X28.12
N$40: D15.A R43.1
N$41: D15.C SJ7.2
N$42: Q10.1(B) R44.2 R45.2
N$43: D18.A Q11.3(C) SJ9.1 X29.12
N$44: D17.A R46.1
N$45: D17.C SJ8.2
N$46: Q11.1(B) R47.2 R48.2
N$47: D20.A Q12.3(C) SJ10.1 X30.12
N$48: D19.A R49.1
N$49: D19.C SJ9.2
N$50: Q12.1(B) R50.2 R51.2
N$51: D22.A Q13.3(C) SJ11.1 X31.12
N$52: D21.A R52.1
N$53: C1A2.+ R1A2.1 R4A1.1
N$54: C1B2.+ R1B2.2 R4B2.1
N$55: R2A2.2 R10.1 U3.6(-IN)
N$56: R2B2.1 R11.1 U3.2(-IN)
N$57: R4A1.2 U3.5(+IN)
N$58: R4B2.2 U3.3(+IN)
N$59: D21.C SJ10.2
N$60: Q13.1(B) R53.2 R54.2
N$61: D24.A Q14.3(C) SJ12.1 X32.12
N$62: D23.A R55.1
N$63: D23.C SJ11.2
N$64: Q14.1(B) R56.2 R57.2
N$65: JP38.1 U$2.3.3V
N$66: D25.A R58.1
N$67: D25.C SJ12.2
N$68: JP38.2 U$2.EN
N$69: D26.A Q15.3(C) SJ13.1 X33.12
N$70: Q15.1(B) R59.2 R60.2
N$71: JP38.3 U$2.GPIO36
N$72: D27.A R61.1
N$73: D27.C SJ13.2
N$74: JP1.2 U1.15(A0)
N$75: JP2.2 U1.16(A1)
N$76: JP3.2 U1.17(A2)
N$77: JP38.4 U$2.GPIO39
N$78: JP38.5 U$2.GPIO34
N$79: JP38.6 U$2.GPIO35
N$80: JP38.7 U$2.GPIO32
N$81: JP38.8 U$2.GPIO33
N$82: JP38.9 U$2.GPIO25
N$83: JP38.10 U$2.GPIO26
N$84: JP38.11 U$2.GPIO27
N$85: JP38.12 U$2.GPIO14
N$86: JP38.13 U$2.GPIO12
N$87: JP31.2 R9.3
N$89: JP38.16 U$2.GPIO9
N$90: JP38.15 U$2.GPIO13
N$91: JP38.17 U$2.GPIO10
N$92: JP38.18 U$2.GPIO11
N$94: JP39.19 U$2.GPIO6
N$95: JP39.18 U$2.GPIO7
N$96: JP39.17 U$2.GPIO8
N$97: JP39.16 U$2.GPIO15
N$98: JP39.15 U$2.GPIO2
N$99: JP39.14 U$2.GPIO0
N$100: JP39.13 U$2.GPIO4
N$101: JP39.12 U$2.GPIO16
N$102: JP39.11 U$2.GPIO17
N$103: JP39.10 U$2.GPIO5
N$104: JP39.9 U$2.GPIO18
N$105: JP39.8 U$2.GPIO19
N$108: JP39.5 U$2.RX
N$109: JP39.4 U$2.TX
N$111: JP39.2 U$2.GPIO23
NISO-PRB-1+: JP6.2 X11.2
NISO-PRB-1GND: JP6.3 X11.1
NISO-PRB-2+: JP8.2 X14.2
NISO-PRB-2GND: JP8.3 X14.1
NISO-PRB-3+: JP10.2 X17.2
NISO-PRB-3GND: JP10.3 X17.1
PWM-OUT-1: R4.2 U2.7(OUT) X2.1
PWM-OUT-2: R5.2 U2.1(OUT) X1.1
PWM-OUT-3: R10.2 U3.7(OUT) X6.1
PWM-OUT-4: R11.2 U3.1(OUT) X7.1
RELAY1PWRIN [HV]: JP11.2 X5.9(SW:P1)
RELAY1PWROUT [HV]: X5.8(SW:S1) X9.1
RELAY2PWRIN [HV]: JP20.2 X23.9(SW:P1)
RELAY2PWROUT [HV]: X9.3 X23.8(SW:S1)
RELAY3PWRIN [HV]: JP21.2 X24.9(SW:P1)
RELAY3PWROUT [HV]: X9.5 X24.8(SW:S1)
RELAY4PWRIN [HV]: JP22.2 X25.9(SW:P1)
RELAY4PWROUT [HV]: X9.7 X25.8(SW:S1)
RELAY5PWRIN [HV]: JP23.2 X26.9(SW:P1)
RELAY5PWROUT [HV]: X13.1 X26.8(SW:S1)
RELAY6PWRIN [HV]: JP25.2 X28.9(SW:P1)
RELAY6PWROUT [HV]: X13.3 X27.8(SW:S1)
RELAY7PWRIN [HV]: JP24.2 X27.9(SW:P1)
RELAY7PWROUT [HV]: X13.5 X28.8(SW:S1)
RELAY8PWRIN [HV]: JP26.2 X29.9(SW:P1)
RELAY8PWROUT [HV]: X13.7 X29.8(SW:S1)
RELAY9PWRIN [HV]: JP27.2 X30.9(SW:P1)
RELAY9PWROUT [HV]: X16.1 X30.8(SW:S1)
RELAY10PWRIN [HV]: JP28.2 X31.9(SW:P1)
RELAY10PWROUT [HV]: X16.3 X31.8(SW:S1)
RELAY11PWRIN [HV]: JP29.2 X33.9(SW:P1)
RELAY11PWROUT [HV]: X16.5 X33.8(SW:S1)
RELAY12PWRIN [HV]: JP30.2 X32.9(SW:P1)
RELAY12PWROUT [HV]: X16.7 X32.8(SW:S1)
SCL [i2c]: IC2.6(BUS1) J1.3 J3.3 J6.1 J7.1 JP5.1 JP7.1 JP9.1 R7.2 R9.2 R12.3 R13.3 R17.3 R20.3 U1.12(SCK) X3.1 X8.3(SCL1) X9.8 X10.3(SCL1) X12.3(SCL1) X13.8 X15.3(SCL1) X16.8
SCL1: JP39.3 R7.1 U$2.GPIO22
SCL2: JP12.1 R14.3 X8.6(SCL2)
SCL3: JP14.1 R16.3 X10.6(SCL2)
SCL4: JP16.1 R18.3 X12.6(SCL2)
SCL5: JP18.1 R21.3 X15.6(SCL2)
SDA [i2c]: IC2.4(BUS2) J1.4 J3.4 J6.2 J7.2 JP5.2 JP7.2 JP9.2 R6.2 R9.1 R12.2 R13.2 R17.2 R20.2 U1.13(SDA) X3.2 X8.2(SDA1) X9.6 X10.2(SDA1) X12.2(SDA1) X13.6 X15.2(SDA1) X16.6
SDA1: JP39.6 R6.1 U$2.GPIO21
SDA2: JP12.2 R14.2 X8.7(SDA2)
SDA3: JP14.2 R16.2 X10.7(SDA2)
SDA4: JP16.2 R18.2 X12.7(SDA2)
SDA5: JP18.2 R21.2 X15.7(SDA2)
Unconnected: R9.4 R9.5 R12.1 R12.4 R12.5 R12.8 R13.1 R13.4 R13.5 R13.8 R14.1 R14.4 R14.5 R14.8 R16.1 R16.4 R16.5 R16.8 R17.1 R17.4 R17.5 R17.8 R18.1 R18.4 R18.5 R18.8 R20.1 R20.4 R20.5 R20.8 R21.1 R21.4 R21.5 R21.8 U1.19(INTB) U1.20(INTA) X5.3(SW:O2) X5.4(SW:P2) X5.5(SW:S2) X5.10(SW:O1) X23.3(SW:O2) X23.4(SW:P2) X23.5(SW:S2) X23.10(SW:O1) X24.3(SW:O2) X24.4(SW:P2) X24.5(SW:S2) X24.10(SW:O1) X25.3(SW:O2) X25.4(SW:P2) X25.5(SW:S2) X25.10(SW:O1) X26.3(SW:O2) X26.4(SW:P2) X26.5(SW:S2) X26.10(SW:O1) X27.3(SW:O2) X27.4(SW:P2) X27.5(SW:S2) X27.10(SW:O1) X28.3(SW:O2) X28.4(SW:P2) X28.5(SW:S2) X28.10(SW:O1) X29.3(SW:O2) X29.4(SW:P2) X29.5(SW:S2) X29.10(SW:O1) X30.3(SW:O2) X30.4(SW:P2) X30.5(SW:S2) X30.10(SW:O1) X31.3(SW:O2) X31.4(SW:P2) X31.5(SW:S2) X31.10(SW:O1) X32.3(SW:O2) X32.4(SW:P2) X32.5(SW:S2) X32.10(SW:O1) X33.3(SW:O2) X33.4(SW:P2) X33.5(SW:S2) X33.10(SW:O1)

## Notes on the sheet
- MC33063ADR_Voltage Step-Down Converter
- MC33063ADR_Voltage Step-Down Converter
- C4 is Tantalum capacitor
- C4 is Tantalum capacitor
- VIN
- 25 V
- Optional Filter | VIN
- 25 V
- Optional Filter
- VOUT = 1.25 (1 + R2/R1)
- 5 V / 500 mA
- VOUT = 1.25 (1 + R2/R1)
- Adjust the value of R1 and R2 to
  get desired output voltage
- 5 V / 500 mA
- Adjust the value of R1 and R2 to
  get desired output voltage
- Output ripple = 500 mVPP
  Output ripple with optional filter = 70 mVPP
- Output ripple = 500 mVPP
  Output ripple with optional filter = 70 mVPP
- Pump Control
- Power Isolation
- Power and Data
- Sensor and Screen
  Connector
- Power supply | I2C Pullups & Shift
- EZO connectors
  non-isolated
- PWM to Analog

## Library data of the parts
C1-C3 C5 C6 C9 = microbuilder:CAP_ELECTROLYTIC: Electrolytic Capacitors SMT PANASONIC_C - Size C Panasonic Electrolytic Aluminum Capacitor 47µF 16V 20% Electrolytic Capacitor [Digikey: PCE3890TR-ND] PANASONIC_D - Size D Panasonic Electrolytic Aluminum Capacitor 100µF 25V 20% Electrolytic Capacitor [Digikey: PCE3898TR-ND] PTH 3.5 mm grid, 8 mm diameter ... 3.5 mm grid, 10 mm diameter ...
C1A1 C1A2 C1B1 C1B2 = rcl:CPOL-US: POLARIZED CAPACITOR, American symbol
C4 C7 C8 C10-C18 = microbuilder:CAP_CERAMIC: Ceramic Capacitors 0402 - 0402 Surface Mount Capacitors 16pF 50V 5% [Digikey: 445-4899-2-ND] 18pF 50V 5% [Digikey: 490-1281-2-ND] 22pF 50V 5% [Digikey: 490-1283-2-ND] 68pF 50V 5% [Digikey: 490-1289-2-ND] 0.1uF 10V 10% [Digikey: 490-1318-2-ND] 1.0uF 6.3V 10% [Digikey: 490-1320-2-ND] 0603 - 0603 Surface Mount Capacitors 16 pF 50V 5% [Digikey: 445-5051-2-ND] 22 pF 50V [Digikey: PCC220ACVTR-ND] 33 pF 50V 5% [Digikey: 490-1415-1-ND] 56pF 50V 5% [Digikey: 490-1421-1-ND] 220pF 50V 5% [Digikey: 445-1285-1-ND] 680 pF 50V 2200 pF 50V 5% C0G [Digikey: 445-1297-1-ND] 5600 pF 100V 5% X7R [Digikey: 478-3711-1-ND] 0.1 µF 25V 10% [Digikey: PCC2277TR-ND] 0.22 µF 16V 10% X7R [Digikey: 445-1318-1-ND] 1.0 µF 25V 10% [Digikey: 445-5146-2-ND] 0603 - RF Specific 3pF 250V +/-0.1pF RF [Digikey: 712-1347-1-ND] 18 pF 250V 5% [Digikey: 478-3505-1-ND or 712-1322-1-ND] 56 pF 250V 5% C0G RF [Digikey: 490-4867-1-ND] 68 pF 250V RF [Digikey: 490-4868-1-ND] 0805 - 0805 Surface Mount Capacitors 220 pF 250V 2% RF Ceramic Capacitor [Digikey: 712-1398-1-ND] 1000 pF 50V 2% NP0 Ceramic Capacitor [Digikey: 478-3760-1-ND] 0.1 µF 25V 10% Ceramic Capacitor [Digikey: PCC1828TR-ND] 1.0 µF 16V 10% Ceramic Capacitor[Digikey: 490-1691-2-ND] 10.0 µF 10V 10% Ceramic Capacitor[Digikey: 709-1228-1-ND] 10.0 uF 16V 10% Ceramic Capacitor [Digikey: 478-5165-2-ND] 47 uF 6.3V 20% Ceramic Capacitor [Digikey: 587-1779-1-ND or 399-5506-1-ND] 1206 - 1206 Surface Mount Capacitors 47uF 10V 20% Ceramic Capacitor [Digikey: 490-5528-1-ND or 399-5508-1-ND or 445-6010-1-ND] 100uF 6.3V -20%, +80% Y5V Ceramic Capacitor (Digikey: 490-4512-1-ND, Mouser: 81-GRM31CF50J107ZE1L)
D1 D2 = diode:1N581*: 1.0A SCHOTTKY BARRIER RECTIFIER Source: http://www.diodes.com/datasheets/ds23001.pdf
D4 D6 D8 D10 D12 D14 D16 D18 D20 D22 D24 D26 = microbuilder:DIODE: Diode SMA Model Volts Amps Type Vf Ir Digikey # Notes SSA34-E3 40V 3A Schottky 480mV @ 3A 200uA @ 40V SSA34-E3/61TGITR-ND CDBA120-G 20V 1A Schottky 500mV @ 1A 500uA @ 20V 641-1014-6-ND REEL MBRA210 10V 2A Schottky 350mV @ 2A 700uA @ 10V MBRA210LT3 SOD-123 Model Volts Amps Type Vf Ir Order # Notes BAT54T1G 30V 200mA Schottky 800mV @ 200mA 2uA @ 25V BAT54T1GOSTR-ND B0530W 30V 500mA Schottky 430mV @ 500mA 130uA @ 30V B0530W-FDICT-ND REEL MBR120 20V 1A Schottky 340mV @ 1A MBR120VLSFT1GOSCT-ND SOD-323 Model Volts Amps Type Vf Ir Order # Notes PMEG2005EJ 20V 500mA Schottky 355mV @ 500mA 568-4110-1-ND ZLLS410 10V 570mA Schottky 380mV @ 570mA ZLLS410CT-ND 1N4148WS 75V 150mA Silicon/Simple 1V 1N4148WSFSCT-ND REEL SOD-523 Model Volts Amps Type Vf Ir Order # Notes BAT54XV2 30V 200mA Schottky 0.8V @ 100mA BAT54XV2CT-ND TB751S 30V 30mA Schottky RB751S-40TE61CT-ND SOT23-R/W (R = Solder Paste/Reflow Ovens, W = Hand-Soldering) Model Volts Amps Type Vf Ir Order # Notes BAT54FILM 40V 300mA Schottky 497-7162-1-ND POWERDI-5 Model Volts Amps Type Vf Ir Order # Notes PDS560 60V 5A Schottky 670mV @ 5A 150uA @ 60V PDS560DICT-ND
D5 D7 D9 D11 D13 D15 D17 D19 D21 D23 D25 D27 = microbuilder:LED: LED 0603 - 0603 Surface Mount Package 2mA: Green LED - Low Power (3.9mcd, 2ma, 1.7Vf) - Digikey: 475-2709-2-ND Orange LED - Low Power (9.8mcd, 2ma, 1.8Vf) - Digikey: 475-1194-2-ND Red LED - Low Power (5mcd, 2ma, 1.8Vf) - Digikey: 475-1195-2-ND Yellow LED - Low Power (7mcd, 2ma, 1.8Vf) - Digikey: 475-1196-2-ND 5mA: Blue LED - Low Power (17mcd, 5ma, 2.9Vf) - Digikey: LNJ937W8CRACT-ND 0805 - 0805 Surface Mount Package 2mA: Red LED (8.8mcd, 2mA, 1.8Vf, Clear) - Low Power [Digikey: 475-2510-1-ND] Green LED (5mcd, 2mA, 1.8Vf, Clear) - Low Power [Digikey: 475-2730-1-ND] Yellow LED (11.3mcd, 2mA, 1.8Vf, Clear) - Low Power [Digikey: 475-2555-1-ND] 20mA: Red LED (104mcd, 20mA, Diffused) - LS R976 [Digikey: 475-1278-6-ND] Red LED (12mcd, 20mA, 2.0Vf, Clear) - APT2012EC [Digikey: 754-1128-1-ND] Green LED (15mcd, 20mA, 2.2Vf, Clear) - APT2012GC [Digikey: 754-1131-1-ND] Orange LED (160mcd, 20mA, 2.1Vf, Clear) - APT2012SECK [Digikey: 754-1130-1-ND] 1206 - 1206 Surface Mount Package Green LED (26mcd, 20mA, Diffused) - LG N971 [Digikey: 475-1407-6-ND] Red LED (15mcd, 20mA, Diffused) - LH N974 [Digikey: 475-1416-6-ND] Cree - Cree High-Power Surface Mount LEDs XPEBWT-L1-0000-00D50 - White 111lm 350mA 2.9Vf 6200K 110° XTEAWT-00-0000-00000LEE3 - White 114lm 350mA 2.85Vf 5000K 115° Everlight - Everlight 45-21 Series Surface Mount LEDs 45-21/QK2C-B2832AC2CB2/2T - Warm White 2000mcd 20mA 3.25Vf 3050K 120° 45-21/LK2C-B38452C4CB2/2T - Nuetral White 2000mcd 20mA 3.25Vf 4150K 120° 45-21/LK2C-B50634C6CB2/2T - Cold White 2200mcd 20mA 3.25Vf 5650K 120° PLCC2 Reverse Mount LS T77K-J1L2-1-0-2-R18-Z - Red 11.25mcd 2mA 1.8Vf 630nm 120° LO T77K-L1M2-24-Z - Orange 19.6mcd 2mA 1.8Vf 606nm 120° LY T77K-K2M1-26-Z - Yellow 15.7mcd 2mA 1.8Vf 587nm 120°
H1-H4 = SparkFun-Hardware:STAND-OFF: Stand Off Drill holes for mechanically mounting via screws, standoffs, etc. Note: Use the keepout ring to avoid running the screw head into surrounding components. Variant Overviews STAND-OFF - Mechanical footprint for a #4 phillips button head screw. STAND-OFF-TIGHT - Mechanical footprint for a #4 phillips button head screw, Example SparkFun Products Screw - Phillips Head (1/4", 4-40, 10 pack) <https://www.sparkfun.com/products/10453> (PRT-10453) Screw - Phillips Head (1/2", 4-40, 10 pack) <https://www.sparkfun.com/products/10452> (PRT-10452) Screw - Phillips Head (3/4", 4-40, 10 pack) <https://www.sparkfun.com/products/10451> (PRT-10451) Screw - Phillips Head (1", 4-40, 10 pack) <https://www.sparkfun.com/products/10450> (PRT-10450)
IC2 = microbuilder:LTC4311
J1 J3 = SparkFun-Connectors:I2C_STANDARD: SparkFun I2C Standard Pinout Header SparkFun has standardized on a pinout for all I2C based sensor breakouts. This pinout allows I2C boards to be plugged directly into the headers on Arduino Uno compatible boards, and to be daisy chained easily. Example SparkFun Products: SparkFun Atmospheric Sensor Breakout - BME280 <https://www.sparkfun.com/products/13676> SparkFun Altitude/Pressure Sensor Breakout - MPL3115A2 <https://www.sparkfun.com/products/11084> SparkFun TOF Range Finder Sensor - VL6180 <https://www.sparkfun.com/products/12785>
J6 J7 = SparkFun-Connectors:QWIIC_CONNECTOR: SparkFun I2C Standard Qwiic Connector An SMD 1mm pitch JST connector makes it easy and quick (get it? Qwiic?) to connect I2C devices to each other. The Qwiic system <http://www.sparkfun.com/qwiic> enables fast and solderless connection between popular platforms and various sensors and actuators. We carry 200mm <https://www.sparkfun.com/products/14204>, 100mm <https://www.sparkfun.com/products/14205>, 50mm <https://www.sparkfun.com/products/14206>, and breadboard friendly <https://www.sparkfun.com/products/14207> Qwiic cables. We also offer 10 pcs strips <https://www.sparkfun.com/products/14323> the SMD connectors.; PROD_ID: CONN-14483
J8 = SparkFun-Connectors:POWER_JACK: Power Jack Connector This is the standard 5.5mm barrel jack for power. The PTH is the most common, proven, reliable, footprint. The Slot footprint only works if the mill layer is transmitted to the PCB fab house so be warned. Here are the connectors we sell at SparkFun: DC Barrel Power Jack/Connector <https://www.sparkfun.com/products/119> (PRT-00119) DC Barrel Power Jack/Connector (SMD) <https://www.sparkfun.com/products/12748> (PRT-12748) DC Barrel Jack Adapter - Breadboard Compatible <https://www.sparkfun.com/products/10811> (PRT-10811) It is used on this SparkFun product (and many, many others): SparkFun RedBoard - Programmed with Arduino <https://www.sparkfun.com/products/12757> (DEV-12757) Also, if you need a mating power supply or connector, please check these out: Wall Adapter Power Supply - 9VDC 650mA <https://www.sparkfun.com/products/298> (TOL-00298) DC Barrel Jack Adapter - Male <https://www.sparkfun.com/products/10287> (PRT-10287); PROD_ID: CONN-08197
JP1-JP3 = microbuilder:HEADER-1X3: PIN HEADER
JP4 JP32 JP33 = microbuilder:HEADER-1X1: PIN HEADER
JP5-JP10 JP12-JP19 = adafruit:PINHD-1X3: PIN HEADER
JP11 JP20-JP30 = pinhead:PINHD-1X3: PIN HEADER
JP31 = microbuilder:JUMPER3: JUMPER - 3 Pins
JP34 JP35 = microbuilder:HEADER-1X2: PIN HEADER
JP38 JP39 = pinhead:PINHD-1X19: PIN HEADER
L1-L4 = rcl:L-US: INDUCTOR, American symbol; SPICEPREFIX: L
PS1-PS4 = RFM-0505S:RFM-0505S: DC/DC Converter, 1 Watt, SIP4, Single Output Check availability <https://pricing.snapeda.com/parts/RFM-0505S/Recom%20Power/view-part?ref=eda>; AVAILABILITY: In Stock; DESCRIPTION: 1W DC/DC-Converter 'ECONOLINE' SIP4 1kV unreg; MF: Recom Power; MP: RFM-0505S; PACKAGE: SIP-4 Recom Power; PRICE: None; PURCHASE-URL: https://pricing.snapeda.com/search/part/RFM-0505S/?ref=eda
Q3 Q5-Q15 = microbuilder:TRANSISTOR_NPN: NPN Transistor Transistor (NPN) 500mA 45V - BC817 [Digikey: 568-1631-1-ND] Transistor (NPN) 500mA 45V - BC817,215 [Mouser: 771-BC817-T/R] SOT23-R - SOT23 footprint optimised for use with solder paste and reflow ovens. SOT23-W - SOT23 footprint optimised for hand-soldering (larger pads).
R1-R8 R10 R11 R15 R19 = rcl:R-US_: RESISTOR, American symbol; SPICEPREFIX: R
R1A1 R1A2 R1B1 R1B2 R2A1 R2A2 R2B1 R2B2 R4A1 R4A2 R4B1 R4B2 R5A1 R5A2 R5B1 R5B2 = adafruit:R-US_: RESISTOR, American symbol
R9 R12-R14 R16-R18 R20 R21 = microbuilder:RESISTOR_4PACK: Resistor Packs (4 resistors) 4 x 0603 10K 1/16W - Digikey: YC164J-10KCT-ND
R26-R61 = microbuilder:RESISTOR: Resistors 0402 - 0402 Surface Mount Package 22 Ohm 1% 1/16W [Digikey: 311-22.0LRTR-ND] 33 Ohm 5% 1/16W 1.0K 5% 1/16W 1.5K 5% 1/16W 2.0K 1% 1/16W 10.0K 1% 1/16W [Digikey: 311-10.0KLRTR-ND] 10.0K 5% 1/16W [Digikey: RMCF0402JT10K0TR-ND] 12.1K 1% 1/16W [Digikey: 311-22.0LRTR-ND] 100.0K 5% 1/16W 0603 - 0603 Surface Mount Package 0 Ohm 1/10 Watt 1% Resistor 15 Ohm 1/10 Watt 1% Resistor 33 Ohm 1/10 Watt 1% Resistor 49.9 Ohm 1/10 Watt 1% Resistor 100 Ohm 1/10 Watt 1% Resistor 150 Ohm 1/10 Watt 1% Resistor 240 Ohm 1/10 Watt 1% Resistor 390 Ohm 1/10 Watt 1% Resistor 560 Ohm 1/10 Watt 1% Resistor 680 Ohm 1/10 Watt 1% Resistor 750 Ohm 1/10 Watt 1% Resistor 1.0K Ohm 1/10 Watt 1% Resistor 1.5K Ohm 1/10 Watt 1% Resistor 2.0K Ohm 1/10 Watt 1% Resistor 2.2K Ohm 1/10 Watt 1% Resistor 3.3K Ohm 1/10 Watt 1% Resistor 4.7K Ohm 1/10 Watt 1% Resistor 10.0K Ohm 1/10 Watt 1% Resistor 12.0K Ohm 1/10 Watt 1% Resistor 12.1K Ohm 1/10 Watt 1% Resistor 20.0K Ohm 1/10 Watt 1% Resistor 33.0K Ohm 1/10 Watt 1% Resistor 100.0K Ohm 1/10 Watt 1% Resistor 0805 - 0805 Surface Mount Package 0 Ohm 1/8 Watt 1% Resistor 33 Ohm 1/8 Watt 1% Resistor 100 Ohm 1/8 Watt 1% Resistor 150 Ohm 1/8 Watt 1% Resistor 200 Ohm 1/8 Watt 1% Resistor 240 Ohm 1/8 Watt 1% Resistor 330 Ohm 1/8 Watt 1% Resistor 390 Ohm 1/8 Watt 1% Resistor 470 Ohm 1/8 Watt 1% Resistor 1.0K Ohm 1/8 Watt 1% Resistor 1.5K Ohm 1/8 Watt 1% Resistor 2.0K Ohm 1/8 Watt 1% Resistor 4.7K Ohm 1/8 Watt 1% Resistor 5.1K Ohm 1/8 Watt 1% Resistor 5.6K Ohm 1/8 Watt 1% Resistor 10.0K Ohm 1/8 Watt 1% Resistor 22.0K Ohm 1/8 Watt 1% Resistor 33.0K Ohm 1/8 Watt 1% Resistor 100K Ohm 1/8 Watt 1% Resistor 1206 - 1206 Surface Mount Package 2012 - 2010 Surface Mount Package 0.11 Ohm 1/2 Watt 1% Resistor - Digikey: RHM.11UCT-ND
SJ2-SJ13 = microbuilder:SOLDERJUMPER_CLOSED: Solder Jumper - Closed These solder jumpers are closed by default CLOSEDWIRE - 10 mil trace between pads that can be cut and resoldered later CLOSEDPERM - 63 mil trace between pads for a permanent connection (used to 'bridge' two signals, a shameless hack for Eagle). Can double as a test point as well (no cream layer)
U1 = MCP23017-E_SO:MCP23017-E/SO: MCP23017 Series 5.5 V 1.7 MHz SMT 16-Bit I2C I/O Expander - SOIC-28 Check availability <https://pricing.snapeda.com/parts/MCP23017-E/SO/Microchip/view-part?ref=eda>; AVAILABILITY: In Stock; DESCRIPTION: I/O Expander 16 I²C 1.7 MHz 28-SOIC; MF: Microchip; MP: MCP23017-E/SO; PACKAGE: SOIC-28 Microchip; PRICE: None; PURCHASE-URL: https://pricing.snapeda.com/search/part/MCP23017-E/SO/?ref=eda
U2 U3 = SparkFun-IC-Amplifiers:LM358: LM358 Jellybean op-amp Datasheet <http://www.sparkfun.com/datasheets/Components/General/LM358.pdf> SparkFun Products Op-Amp (Thru-Hole) - LM358 <https://www.sparkfun.com/products/9456> (COM-09456)
U4 U5 = MC34063ADR:MC34063ADR; MANUFACTURER_PART_NUMBER: MC34063ADR; VENDOR: Texas Instruments
U$2 = ESP32:ESP32
X1-X3 X6 X7 X11 X14 X17 X22 = Rembrandt Electronics - JST XH Connectors v1-0:JST-XH-02-PIN: JST XH Connector 2 Pin Wire to board connector. Pitch: 2,54 mm, (0.100") Number of pins: 2 Created by Rembrandt Electronics www.rembrandtelectronics.com
X5 X23-X33 = microbuilder:RELAY_NONLATCHING
X8 X10 X12 X15 = adafruit_power:ISO154X
X9 X13 X16 = con-tycoelectronics:RJ45: CORCOM Modular RJ Jacks No Shield Source: www.tycoelectronics.com .. ENG_DS_1654001_1099_RJ_L_0507.pdf; MPN: RJ45-6L-B; OC_FARNELL: unknown; OC_NEWARK: 16R6090
X18-X21 = con-coax:BU-SMA-G: FEMALE SMA CONNECTOR Radiall distributor RS 193-9117; OC_FARNELL: unknown; OC_NEWARK: unknown

## Net classes
0 default: width 0.254 mm, clearance 0.203 mm
1 HV: width 0.406 mm, drill 0.381 mm, clearance 1.016 mm
2 12v: width 0.457 mm, drill 0.102 mm, clearance 0.254 mm
3 5v: width 0.406 mm, drill 0.102 mm, clearance 0.254 mm
4 3.3v: width 0.406 mm, drill 0.102 mm, clearance 0.254 mm
5 i2c: width 0.356 mm, drill 0.102 mm, clearance 0.254 mm
6 GPIO: width 0.356 mm, drill 0.102 mm, clearance 0.254 mm
8 New Class: drill 0.102 mm, clearance 0.152 mm